# EasyEDA Pro project esp32s3_del_v1.eprj

# Schematic Schematic1
Board Name: Board1; Create Date: 2025-03-21; Page Name: P1; Project Name: esp32s3_del_v1; Schematic Name: Schematic1; Update Date: 2025-03-30; Company: EasyEDA.com; Page Size: A4; Version: V1.0
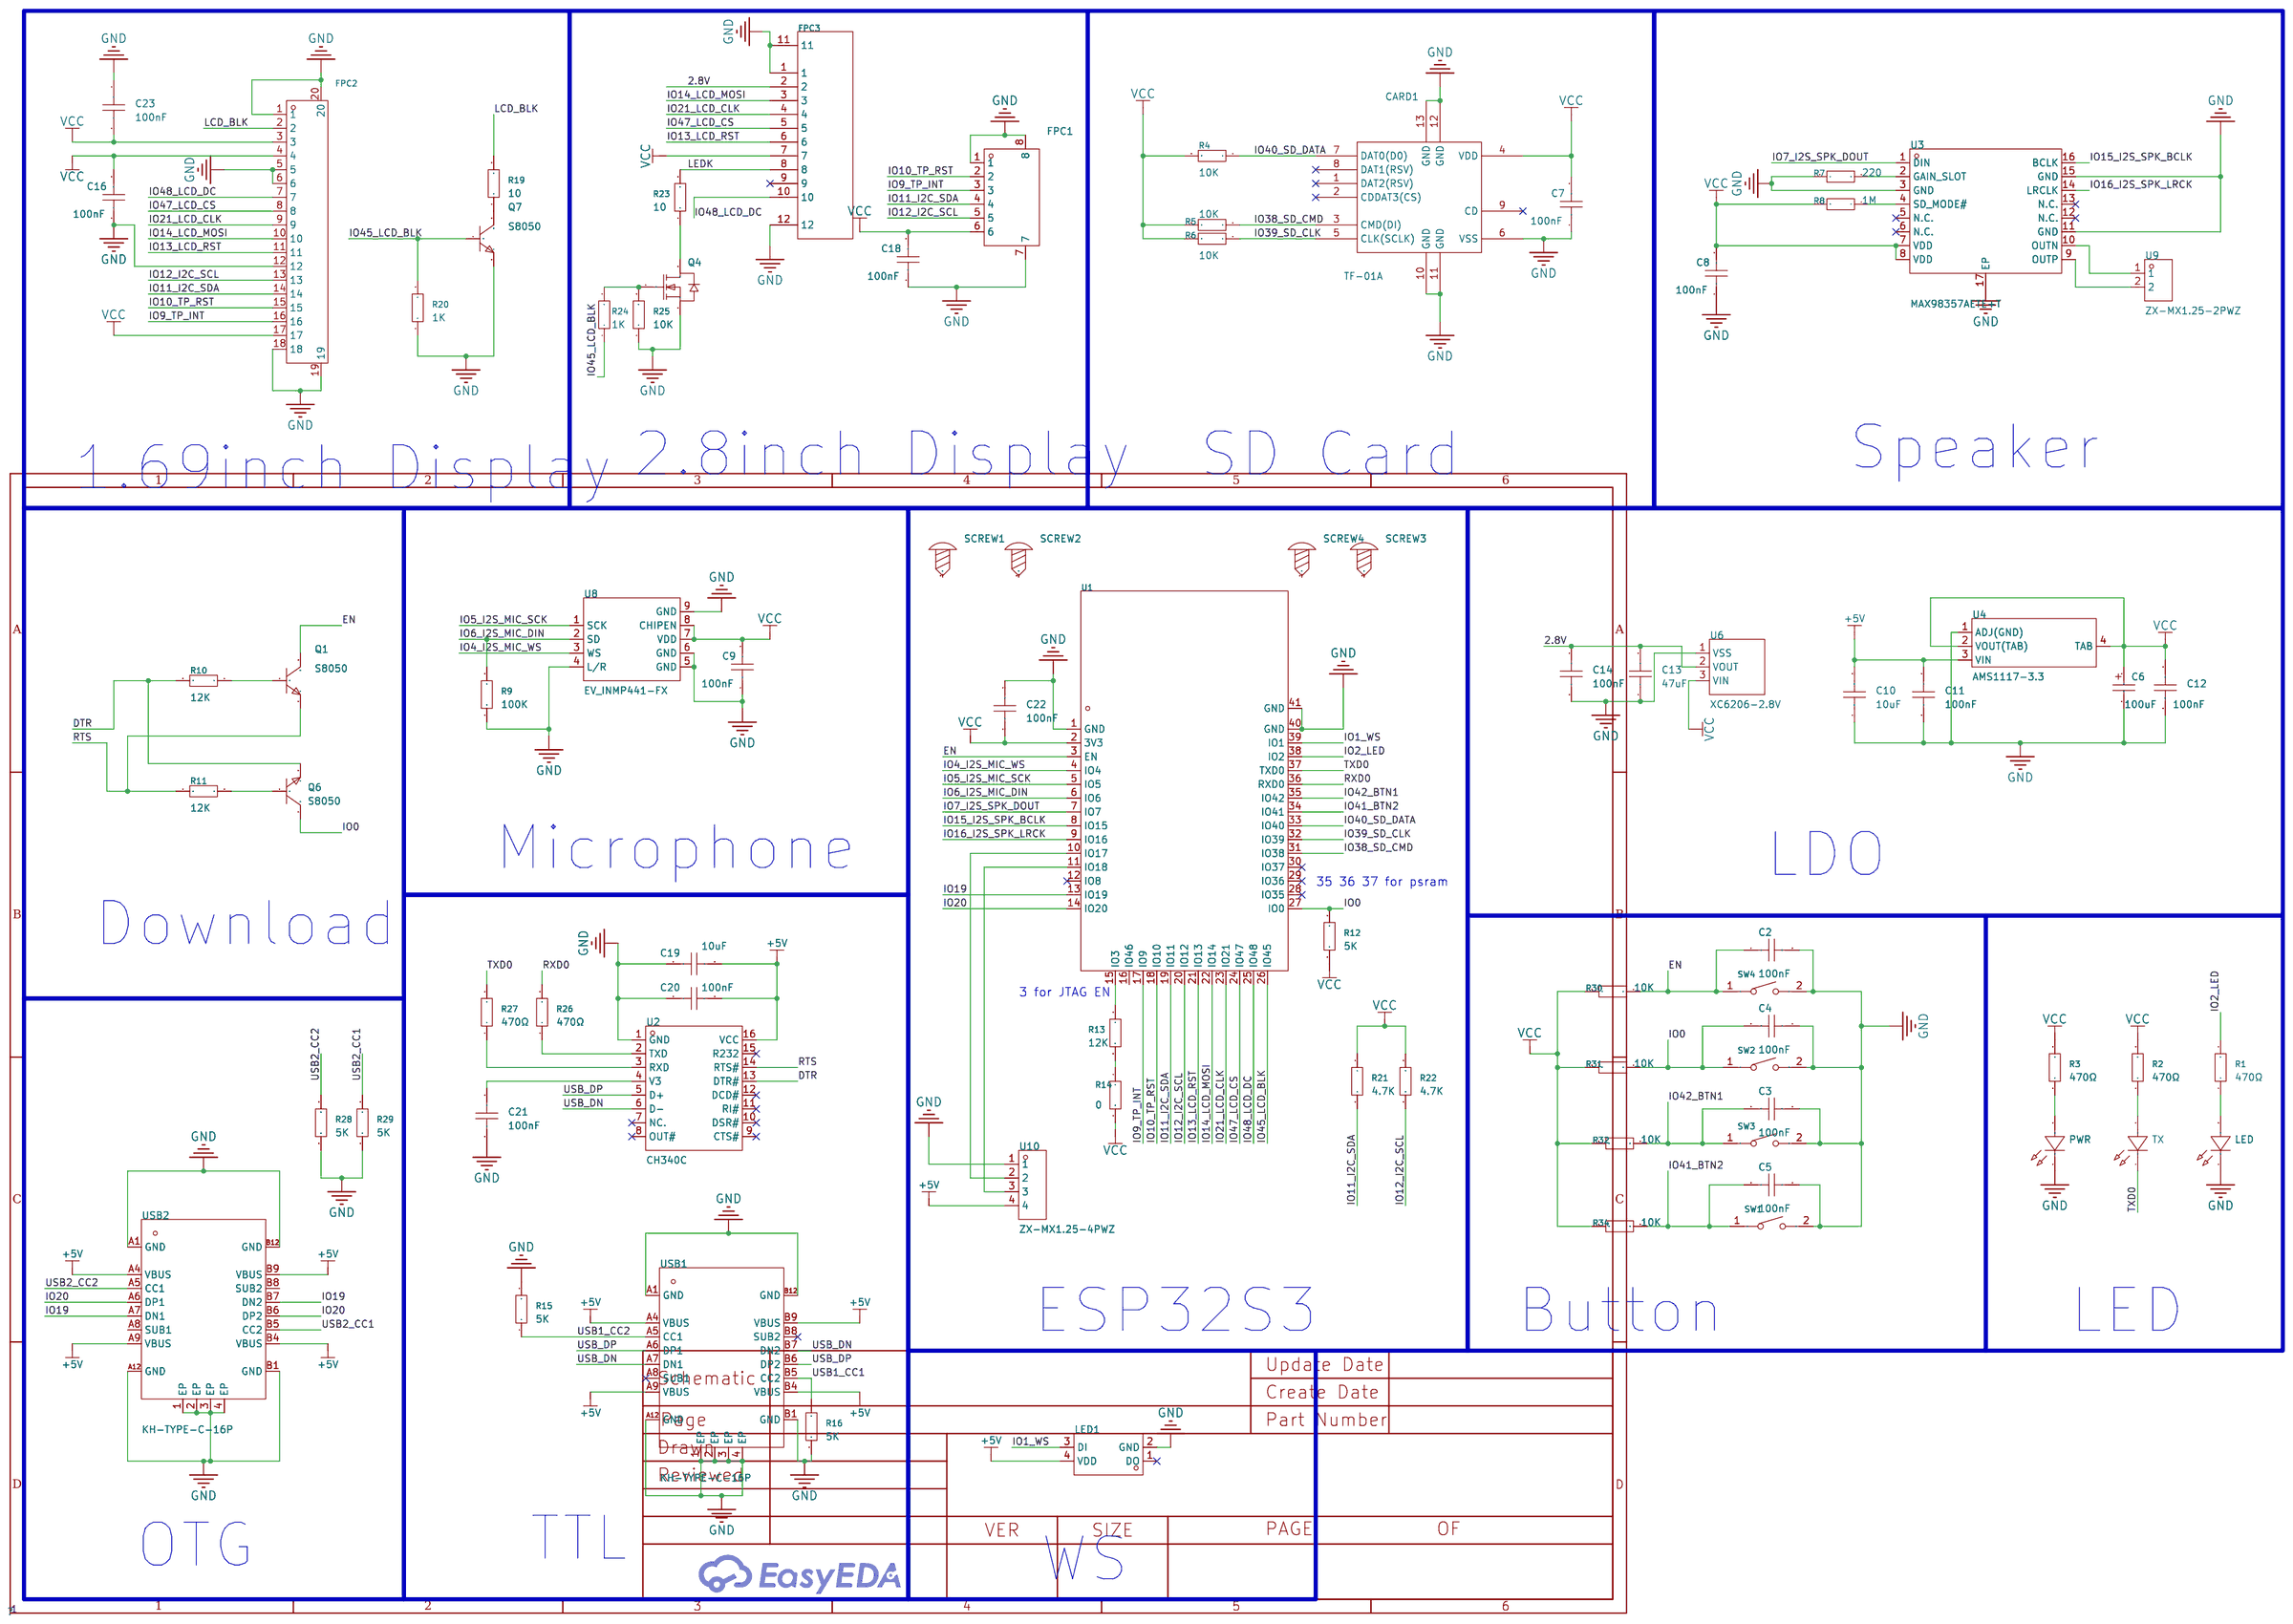
[diagram p0: schematic sheet]

## Parts
C2  100nF  [C0402]
C3  100nF  [C0402]
C4  100nF  [C0402]
C5  100nF  [C0402]
C6  100uF  [CASE-B_3528]
C7  100nF  [C0402]
C8  100nF  [C0402]
C9  100nF  [C0402]
C10  10uF  [C0603]
C11  100nF  [C0402]
C12  100nF  [C0402]
C13  47uF  [C0603]
C14  100nF  [C0402]
C16  100nF  [C0402]
C18  100nF  [C0402]
C19  10uF  [C0603]
C20  100nF  [C0402]
C21  100nF  [C0402]
C22  100nF  [C0402]
C23  100nF  [C0402]
CARD1  TF-01A  [TF-SMD_TF-01A]
FPC1  0.5K-DX-6PWBG  [FPC-SMD_6P-P0.50_DEALON_0.5K-DX-6PWB]
FPC2  FPC-05F-18PH20  [FPC-SMD_18P-P0.50_FPC-05F-18PH20]
FPC3  AFC07-S10ECA-00  [FPC-SMD_P0.50-10P_LCS-SJ-H2.0]
LED  XL-1608SURC-06  [LED0603-RD_RED]
LED1  XL-2020RGBC-WS2812B  [LED-SMD_4P-L2.0-W2.0-BR-1]
PWR  XL-1608SURC-06  [LED0603-RD_RED]
Q1  S8050  [SOT-23-3_L2.9-W1.3-P1.90-LS2.3-BR]
Q4  Si2302CDS-T1-GE3  [SOT-23_L2.9-W1.3-P1.90-LS2.4-BR]
Q6  S8050  [SOT-23-3_L2.9-W1.3-P1.90-LS2.3-BR]
Q7  S8050  [SOT-23-3_L2.9-W1.3-P1.90-LS2.3-BR]
R1  470Ω  [R0402]
R2  470Ω  [R0402]
R3  470Ω  [R0402]
R4  10K  [R0402]
R5  10K  [R0402]
R6  10K  [R0402]
R7  220  [R0402]
R8  1M  [R0402]
R9  100K  [R0402]
R10  12K  [R0402]
R11  12K  [R0402]
R12  5K  [R0402]
R13  12K  [R0402]
R14  0  [R0402]
R15  5K  [R0402]
R16  5K  [R0402]
R19  10  [R0402]
R20  1K  [R0402]
R21  4.7K  [R0402]
R22  4.7K  [R0402]
R23  10  [R0402]
R24  1K  [R0402]
R25  10K  [R0402]
R26  470Ω  [R0402]
R27  470Ω  [R0402]
R28  5K  [R0402]
R29  5K  [R0402]
R30  10K  [R0402]
R31  10K  [R0402]
R32  10K  [R0402]
R34  10K  [R0402]
SCREW1  -  [Screw-Hole-M2]
SCREW2  -  [Screw-Hole-M2]
SCREW3  -  [Screw-Hole-M2]
SCREW4  -  [Screw-Hole-M2]
SW1  TS-1088-AR02016  [SW-SMD_L3.9-W3.0-P4.45]
SW2  TS-1088-AR02016  [SW-SMD_L3.9-W3.0-P4.45]
SW3  TS-1088-AR02016  [SW-SMD_L3.9-W3.0-P4.45]
SW4  TS-1088-AR02016  [SW-SMD_L3.9-W3.0-P4.45]
TX  XL-1608SURC-06  [LED0603-RD_RED]
U1  ESP32-S3-WROOM-1-N16R8  [WIRELM-SMD_ESP32-S3-WROOM-1]
U2  CH340C  [SOP-16_L10.0-W3.9-P1.27-LS6.0-BL]
U3  MAX98357AETE+T  [TQFN-16_L3.0-W3.0-P0.50-BL-EP1.5]
U4  AMS1117-3.3  [SOT-223-4_L6.5-W3.5-P2.30-LS7.0-BR]
U6  XC6206-2.8V  [SOT-23-3_L2.9-W1.6-P1.90-LS2.8-BR]
U8  EV_INMP441-FX  [MID-SMD_L4.7-W3.8_INMP441ACEZ]
U9  ZX-MX1.25-2PWZ  [CONN-TH_2P-P1.25_ZX-MX1.25-2PWZ]
U10  ZX-MX1.25-4PWZ  [CONN-TH_4P-P1.25_ZX-MX1.25-4PWZ]
USB1  KH-TYPE-C-16P  [USB-C-SMD_KH-TYPE-C-16P]
USB2  KH-TYPE-C-16P  [USB-C-SMD_KH-TYPE-C-16P]

## Library data of the parts
C2-C5 C7-C9 C11 C12 C14 C16 C18 C20-C23 = CL05B104KO5NNNC: LCSC Part Name: 100nF ±10% 16V; Supplier Part: C1525; Manufacturer: SAMSUNG(三星); Supplier Footprint: 0402; JLCPCB Part Class: Basic Part; Datasheet: https://atta.szlcsc.com/upload/public/pdf/source/20160218/1457707763339.pdf; Supplier: LCSC; Tolerance: ±10%
C6 = TAJB107K006RNJ: LCSC Part Name: 100uF ±10% 6.3V; Supplier Part: C16133; Manufacturer: Kyocera AVX; Supplier Footprint: CASE-B-3528-21(mm); JLCPCB Part Class: Basic Part; Datasheet: https://atta.szlcsc.com/upload/public/pdf/source/20160107/1457707750344.pdf; Supplier: LCSC; Tolerance: ±10%; Equivalent Series Resistance(ESR): 1.7Ω@100kHz; Operating Temperature: -55℃~+125℃
C10 C13 C19 = CGA0603X5R106K100JT: LCSC Part Name: 10uF ±10% 10V; Supplier Part: C6119842; Manufacturer: HRE(芯声); Supplier Footprint: 0603; JLCPCB Part Class: Extended Part; Supplier: LCSC; Tolerance: ±10%; Voltage Rating: 10V; Temperature Coefficient: X5R
CARD1 = TF-01A_C91145: LCSC Part Name: 自弹式 MicroSD卡(TF卡) 卡座; Supplier Part: C91145; Manufacturer: 韩国韩荣; Supplier Footprint: SMD; JLCPCB Part Class: Extended Part; Datasheet: https://atta.szlcsc.com/upload/public/pdf/source/20190322/C91145_63CBD6FB4639A3A3EC6A9721F18AE0FB.pdf; Supplier: LCSC; Card Connection Mode: Self-bouncing; Card Type: MicroSD card (TF card); Connector Type: Card Slot; Supplementary Features: With Locating Pin; Maximum Body Height: 1.85mm
FPC1 = 0.5K-DX-6PWBG: LCSC Part Name: 间距:0.5mm P数:6P 翻盖式 下接; Supplier Part: C2911878; Manufacturer: HDGC(华德共创); Supplier Footprint: SMD,P=0.5mm,卧贴; JLCPCB Part Class: Extended Part; Datasheet: https://atta.szlcsc.com/upload/public/pdf/source/20211029/EDC59C5BA257836333CAE013AFC084A6.pdf; Supplier: LCSC; Locking Feature: Flip type; Contact Type: Bottom Contact; Number of Contacts: 6P; Pitch: 0.5mm; Mounting Type: Horizontal attachment; FFC, FCB Thickness: 0.3mm; Height Above Board: 2mm; Operating Temperature Range: -20℃~+85℃
FPC2 = FPC-05F-18PH20: LCSC Part Name: 间距:0.5mm P数:18P 翻盖式 下接; Supplier Part: C2856802; Manufacturer: XUNPU(讯普); Supplier Footprint: SMD,P=0.5mm,卧贴; JLCPCB Part Class: Extended Part; Datasheet: https://atta.szlcsc.com/upload/public/pdf/source/20210922/C2856802_2A845D1961F33AEC1ED22CECB292335F.pdf; Supplier: LCSC; Locking Feature: Clamshell; Contact Type: Bottom Contact; Number of Contacts: 18P; Pitch: 0.5mm; Mounting Type: 卧贴; FFC, FCB Thickness: 0.3mm; Height Above Board: 2mm; Operating Temperature Range: -25℃~+85℃
FPC3 = AFC07-S10ECA-00: LCSC Part Name: 间距:0.5mm P数:10P 抽屉式 上接; Supplier Part: C262583; Manufacturer: JS(钜硕电子); Supplier Footprint: SMD,P=0.5mm,卧贴; JLCPCB Part Class: Extended Part; Datasheet: https://atta.szlcsc.com/upload/public/pdf/source/20190726/C11082_A2E7B12387019CE4314BB5199EE0FDF4.pdf; Supplier: LCSC; Locking Feature: 抽屉式; Contact Type: Contact,Top; Number of Contacts: 10P; Pitch: 0.5mm; Mounting Type: 卧贴; FFC, FCB Thickness: 0.3mm; Height Above Board: 2mm
LED PWR TX = XL-1608SURC-06: Supplier Part: C965799; Manufacturer: XINGLIGHT(成兴光); Supplier Footprint: 0603; JLCPCB Part Class: Extended Part; Datasheet: https://atta.szlcsc.com/upload/public/pdf/source/20250213/F9766CE804AF391355DCDD48DB3E0DAB.pdf; Supplier: LCSC; Illumination Color: Red; Voltage - Forward(Vf): 2.3V; Power(Watts): 50mW; Forward Current: 20mA; Wavelength - Dominant: 620nm~630nm; Peak Wavelength: 625nm; Lens Color: Colorless Transparent Lens; Luminous Intensity: 225mcd; Viewing Angle: 120°; Mounting Sytle: Positive Stick; Operating Temperature: -20℃~+85℃
LED1 = XL-2020RGBC-WS2812B: LCSC Part Name: 幻彩透明; Supplier Part: C5349955; Manufacturer: XINGLIGHT(成兴光); Supplier Footprint: 2020; JLCPCB Part Class: Extended Part; Datasheet: https://atta.szlcsc.com/upload/public/pdf/source/20230111/97A2D5930F183799801175706AF118AF.pdf; Supplier: LCSC; Wavelength: 620nm~625nm；470nm~475nm；525nm~530nm; Luminous Intensity: 150mcd；150mcd；400mcd; Lens Color: Translucent Fog Lens; Installation method: Positive Stick; Operating Temperature: -20℃~+85℃
Q1 Q6 Q7 = S8050_C20069125: LCSC Part Name: hFE:200-350，丝印:J3Y S8050; Supplier Part: C20069125; Manufacturer: 宏嘉诚; Supplier Footprint: SOT-23; JLCPCB Part Class: Extended Part; Datasheet: https://atta.szlcsc.com/upload/public/pdf/source/20250107/343E8B94B5C24D0D65D7D4B70E0B73F6.pdf; Supplier: LCSC; type: NPN; Pd - Power Dissipation: 300mW; DC Current Gain: 120@50mA,1.0V; Transition frequency(fT): 100MHz; Current - Collector Cutoff: 100nA; Vce Saturation(VCE(sat)): 600mV; Operating Temperature: -55℃~+150℃
Q4 = Si2302CDS-T1-GE3: LCSC Part Name: 1个N沟道 耐压:20V 电流:2.9A; Supplier Part: C10488; Manufacturer: VISHAY(威世); Supplier Footprint: SOT-23; JLCPCB Part Class: Extended Part; Datasheet: https://atta.szlcsc.com/upload/public/pdf/source/20121215/1457706570095.pdf; Supplier: LCSC; Type: 1 N-Channel; Drain Source On Resistance (RDS(on)@Vgs,Id): 0.057Ω@4.5V,3.6A; Power Dissipation (Pd): 550mW; Gate Threshold Voltage (Vgs(th)@Id): 850mV@250uA; Total Gate Charge (Qg@Vgs): 3.5nC@4.5V; Input Capacitance (Ciss@Vds): 320pF@10V; Reverse Transfer Capacitance (Crss@Vds): 5pF@10V; Operating Temperature: -55℃~+150℃
R1-R16 R19-R32 R34 = 0402WGF4700TCE: LCSC Part Name: 470Ω ±1% 62.5mW 厚膜电阻; Supplier Part: C25117; Manufacturer: UNI-ROYAL(厚声); Supplier Footprint: 0402; JLCPCB Part Class: Basic Part; Datasheet: https://atta.szlcsc.com/upload/public/pdf/source/20200306/C422600_1E6D84923E4A46A82E41ADD87F860B5C.pdf; Supplier: LCSC; Type: Thick Film Resistors; Tolerance: ±1%; Temperature Coefficient: ±100ppm/℃; Operating Temperature Range: -55℃~+155℃
SCREW1-SCREW4 = Screw-Hole-M2: Supplier Footprint: 插件
SW1-SW4 = TS-1088-AR02016: LCSC Part Name: 4*3*2mm 立贴 轻触开关; Supplier Part: C720477; Manufacturer: XUNPU(讯普); Supplier Footprint: SMD; JLCPCB Part Class: Extended Part; Datasheet: https://atta.szlcsc.com/upload/public/pdf/source/20200810/C720475_60D09DD6C54279ADDB2DC25100F1CC11.pdf; Supplier: LCSC; Circuit: SPST; Actuator Style: Round Button; Operating Force: 160gf; Mounting Style: Brick nogging; Switch Length: 4mm; Switch Width: 3mm; Switch Height: 2mm; Strike Gundam: 不带; Contact Current: 50mA; Voltage Rating (DC): 12V; Insulation Resistance: 100MΩ; Actuator/Cap Color: Black; Pin Style: SMDSplicing; Mechanical Life: 10万次; Operating Temperature: -30℃~+80℃
U1 = ESP32-S3-WROOM-1-N16R8: LCSC Part Name: 通用型Wi-Fi+低功耗蓝牙MCU模组; Supplier Part: C2913202; Manufacturer: ESPRESSIF(乐鑫); Supplier Footprint: SMD,18x25.5mm; JLCPCB Part Class: Extended Part; Datasheet: https://atta.szlcsc.com/upload/public/pdf/source/20220705/4E799F39581577F766659887F738A439.pdf; Supplier: LCSC
U2 = CH340C: LCSC Part Name: CH340C USB转串口芯片 CH340; Supplier Part: C84681; Manufacturer: WCH(南京沁恒); Supplier Footprint: SOP-16; JLCPCB Part Class: Extended Part; Datasheet: https://atta.szlcsc.com/upload/public/pdf/source/20240619/63986D8440D4E5267A77ACD891CC4DE3.pdf; Supplier: LCSC; Applications Function: Transceiver; Supply Voltage: 3.3V；5V; Data Rate: 2Mbps
U3 = MAX98357AETE+T: LCSC Part Name: 微型、低成本、PCM 类 D 级放大器具有 AB 级性能; Supplier Part: C910544; Manufacturer: ADI(亚德诺)/MAXIM(美信); Supplier Footprint: TQFN-16-EP(3x3); JLCPCB Part Class: Extended Part; Datasheet: https://atta.szlcsc.com/upload/public/pdf/source/20210106/C910544_CB6DE4B2CEE254A72E6BDB40E718D281.pdf; Supplier: LCSC; Speaker Channels: Monaural; Supply Voltage: 2.5V~5.5V; Operating Temperature: -40℃~+85℃
U4 = AMS1117-3.3_C347222: LCSC Part Name: 输出:3.3V 电流:1A 耐压:12V; Supplier Part: C347222; Manufacturer: UMW(友台半导体); Supplier Footprint: SOT-223; JLCPCB Part Class: Extended Part; Datasheet: https://atta.szlcsc.com/upload/public/pdf/source/20241218/BAF0263FA2E44BCD8AF41AA4FA04EFAA.pdf; Supplier: LCSC; Output Type: Fixed; Voltage - Supply: 12V; Output Voltage: 3.3V; Output Current: 1A; Power Supply Rejection Ratio (PSRR): 60dB@(120Hz); Voltage Dropout: 1.3V@(1A); Features: Overcurrent Protection; Output Configuration: Positive electrode; Number of Outputs: 1
U6 = XC6206-2.8V: LCSC Part Name: 输入6V 输出2.8V 250mA; Supplier Part: C2892669; Manufacturer: YONGYUTAI(永裕泰); Supplier Footprint: SOT-23-3L; JLCPCB Part Class: Extended Part; Datasheet: https://atta.szlcsc.com/upload/public/pdf/source/20210901/DE3C77F0CE73FFE8F7C655BE9B94CB06.pdf; Supplier: LCSC; Output Type: Fixed; Voltage - Supply: 6V; Output Voltage: 2.8V; Output Current: 250mA; Features: Short-Circuit  Protection(SCP)；Low ESR；Overcurrent Protection(OCP); Operating Temperature: -40℃~+85℃@(Tj); Output Configuration: Positive electrode; Number of Outputs: 1
U8 = EV_INMP441-FX: Supplier Part: C17499176; Manufacturer: TDK InvenSense(应美盛); JLCPCB Part Class: Extended Part; Supplier: LCSC; Sensor Type: Audio
U9 = ZX-MX1.25-2PWZ: LCSC Part Name: 1x2P 间距:1.25mm 弯插 系列:PicoBlade(MX 1.25) 配套胶壳型号：ZX-MX1.25-2PJK 配套端子型号：ZX-MX1.25-DZ 配套杜邦线型号：ZX-MX1.25-2PBXC; Supplier Part: C7430463; Manufacturer: Megastar(兆星); Supplier Footprint: 弯插,P=1.25mm; JLCPCB Part Class: Extended Part; Datasheet: https://atta.szlcsc.com/upload/public/pdf/source/20230619/EFC7482EB916E36F9EF0B03A9637C24F.pdf; Supplier: LCSC; Pins Structure: 1x2P; Pitch: 1.25mm; Mounting Style: Bend-in; Reference Series: PicoBlade(MX 1.25); Number of Pins: 2P; Number of Rows: 1; Number of PINs Per Row: 2; Contact Material: Brass; Contact Plating: Tin; Colour: White; Z-Height of the Board: 3.3mm; X-Length of Bottom Edge on Board (Spacing Line): 4.4mm; Y-Width of Bottom Edge on Board: 4.6mm
U10 = ZX-MX1.25-4PWZ: LCSC Part Name: 1x4P 间距:1.25mm 弯插 系列:PicoBlade(MX 1.25) 配套胶壳型号：ZX-MX1.25-4PJK 配套端子型号：ZX-MX1.25-DZ 配套杜邦线型号：ZX-MX1.25-4PBXC; Supplier Part: C7430465; Manufacturer: Megastar(兆星); Supplier Footprint: 弯插,P=1.25mm; JLCPCB Part Class: Extended Part; Datasheet: https://atta.szlcsc.com/upload/public/pdf/source/20230619/13E052D24268A9BEC4967A3768BAD5AA.pdf; Supplier: LCSC; Pins Structure: 1x4P; Pitch: 1.25mm; Mounting Style: Bend-in; Reference Series: PicoBlade(MX 1.25); Number of Pins: 4P; Number of Rows: 1; Number of PINs Per Row: 4; Contact Material: Brass; Contact Plating: Tin; Colour: White; Z-Height of the Board: 3.3mm; X-Length of Bottom Edge on Board (Spacing Line): 6.9mm; Y-Width of Bottom Edge on Board: 4.6mm
USB1 USB2 = KH-TYPE-C-16P: LCSC Part Name: Type-C 母 卧贴; Supplier Part: C709357; Manufacturer: kinghelm(金航标); Supplier Footprint: SMD; JLCPCB Part Class: Extended Part; Datasheet: https://atta.szlcsc.com/upload/public/pdf/source/20200911/C709357_AA8DCEB38BB20E3035A7ED7AE7667837.pdf; Supplier: LCSC; Connector Type: Type-C; Gender: Female; Number of Ports: 1; Number of Contacts: 16P; Mounting Style: 卧贴; Current Rating - Power (Max): 3A; Operating Temperature Range: -40℃~+85℃

## Nets
2.8V: C13.2 C14.1 FPC3.2 U6.2(VOUT)
+5V: C10.2 C11.1 C19.1 C20.2 LED1.4(VDD) U2.16(VCC) U4.3(VIN) U10.4 USB1.A4(VBUS) USB1.A9(VBUS) USB1.B4(VBUS) USB1.B9(VBUS) USB2.A4(VBUS) USB2.A9(VBUS) USB2.B4(VBUS) USB2.B9(VBUS)
GND: C2.2 C3.1 C4.1 C5.1 C6.2 C7.1 C8.1 C9.1 C10.1 C11.2 C12.2 C13.1 C14.2 C16.1 C18.1 C19.2 C20.1 C21.1 C22.1 C23.1 CARD1.6(VSS) CARD1.10(GND) CARD1.11(GND) CARD1.12(GND) CARD1.13(GND) FPC1.1 FPC1.7 FPC1.8 FPC2.1 FPC2.5 FPC2.6 FPC2.12 FPC2.18 FPC2.19 FPC2.20 FPC3.1 FPC3.11 FPC3.12 LED.1(K) LED1.2(GND) PWR.1(K) Q4.2(S) Q7.2(E) R7.2 R9.1 R15.2 R16.1 R20.1 R25.1 R28.1 R29.1 SW1.2 SW2.2 SW3.2 SW4.2 U1.1(GND) U1.40(GND) U1.41(GND) U2.1(GND) U3.3(GND) U3.11(GND) U3.15(GND) U3.17(EP) U4.1(ADJ(GND)) U6.1(VSS) U8.4(L/R) U8.5(GND) U8.6(GND) U8.9(GND) U10.1 USB1.1(EP) USB1.2(EP) USB1.3(EP) USB1.4(EP) USB1.A1(GND) USB1.A12(GND) USB1.B1(GND) USB1.B12(GND) USB2.1(EP) USB2.2(EP) USB2.3(EP) USB2.4(EP) USB2.A1(GND) USB2.A12(GND) USB2.B1(GND) USB2.B12(GND)
VCC: C6.1 C7.2 C8.2 C9.2 C12.1 C16.2 C18.2 C22.2 C23.2 CARD1.4(VDD) FPC1.6 FPC2.3 FPC2.4 FPC2.17 FPC3.7 R2.2 R3.2 R4.2 R5.2 R6.2 R8.2 R12.2 R14.2 R21.1 R22.1 R30.2 R31.2 R32.2 R34.2 U1.2(3V3) U3.7(VDD) U3.8(VDD) U4.2(VOUT(TAB)) U4.4(TAB) U6.3(VIN) U8.7(VDD) U8.8(CHIPEN)
DTR: Q6.2(E) R10.2 U2.13(DTR#)
EN: C2.1 Q1.3(C) R30.1 SW4.1 U1.3(EN)
IO0: C4.2 Q6.3(C) R12.1 R31.1 SW2.1 U1.27(IO0)
IO1_WS: LED1.3(DI) U1.39(IO1)
IO2_LED: R1.2 U1.38(IO2)
IO4_I2S_MIC_WS: U1.4(IO4) U8.3(WS)
IO5_I2S_MIC_SCK: U1.5(IO5) U8.1(SCK)
IO6_I2S_MIC_DIN: R9.2 U1.6(IO6) U8.2(SD)
IO7_I2S_SPK_DOUT: U1.7(IO7) U3.1(DIN)
IO9_TP_INT: FPC1.3 FPC2.16 U1.17(IO9)
IO10_TP_RST: FPC1.2 FPC2.15 U1.18(IO10)
IO11_I2C_SDA: FPC1.4 FPC2.14 R21.2 U1.19(IO11)
IO12_I2C_SCL: FPC1.5 FPC2.13 R22.2 U1.20(IO12)
IO13_LCD_RST: FPC2.11 FPC3.6 U1.21(IO13)
IO14_LCD_MOSI: FPC2.10 FPC3.3 U1.22(IO14)
IO15_I2S_SPK_BCLK: U1.8(IO15) U3.16(BCLK)
IO16_I2S_SPK_LRCK: U1.9(IO16) U3.14(LRCLK)
IO19: U1.13(IO19) USB2.A7(DN1) USB2.B7(DN2)
IO20: U1.14(IO20) USB2.A6(DP1) USB2.B6(DP2)
IO21_LCD_CLK: FPC2.9 FPC3.4 U1.23(IO21)
IO38_SD_CMD: CARD1.3(CMD(DI)) R5.1 U1.31(IO38)
IO39_SD_CLK: CARD1.5(CLK(SCLK)) R6.1 U1.32(IO39)
IO40_SD_DATA: CARD1.7(DAT0(D0)) R4.1 U1.33(IO40)
IO41_BTN2: C5.2 R34.1 SW1.1 U1.34(IO41)
IO42_BTN1: C3.2 R32.1 SW3.1 U1.35(IO42)
IO45_LCD_BLK: Q7.1(B) R20.2 R24.1 U1.26(IO45)
IO47_LCD_CS: FPC2.8 FPC3.5 U1.24(IO47)
IO48_LCD_DC: FPC2.7 FPC3.10 U1.25(IO48)
LCD_BLK: FPC2.2 R19.2
LEDK: FPC3.8 R23.2
RTS: Q1.2(E) R11.2 U2.14(RTS#)
RXD0: R26.2 U1.36(RXD0)
TXD0: R27.2 TX.1(K) U1.37(TXD0)
USB1_CC1: R16.2 USB1.B5(CC2)
USB1_CC2: R15.1 USB1.A5(CC1)
USB2_CC1: R29.2 USB2.B5(CC2)
USB2_CC2: R28.2 USB2.A5(CC1)
USB_DN: U2.6(D-) USB1.A7(DN1) USB1.B7(DN2)
USB_DP: U2.5(D+) USB1.A6(DP1) USB1.B6(DP2)
$1N5016: R7.1 U3.2(GAIN_SLOT)
$1N5089: R8.1 U3.4(SD_MODE#)
$1N5351: U3.10(OUTN) U9.1
$1N5372: U3.9(OUTP) U9.2
$1N6944: Q1.1(B) R10.1
$1N6949: Q6.1(B) R11.1
$1N7412: PWR.2(A) R3.1
$1N7416: R2.1 TX.2(A)
$1N7421: LED.2(A) R1.1
$1N7694: R13.1 U1.15(IO3)
$1N7805: R13.2 R14.1
$1N9339: Q4.1(G) R24.2 R25.2
$1N9344: Q4.3(D) R23.1
$1N9896: R26.1 U2.2(TXD)
$1N9901: R27.1 U2.3(RXD)
$1N9958: C21.2 U2.4(V3)
$1N14603: U1.10(IO17) U10.2
$1N14611: U1.11(IO18) U10.3
$1N17288: Q7.3(C) R19.1

Not connected (* = marked no-connect by the designer): CARD1 1(DAT2(RSV))* 2(CDDAT3(CS))* 8(DAT1(RSV))* 9(CD)*; FPC3 9*; LED1 1(DO)*; SCREW1 1; SCREW2 1; SCREW3 1; SCREW4 1; U1 12(IO8)* 16(IO46) 28(IO35)* 29(IO36)* 30(IO37)*; U2 7(NC.)* 8(OUT#)* 9(CTS#)* 10(DSR#)* 11(RI#)* 12(DCD#)* 15(R232)*; U3 5(N.C.)* 6(N.C.)* 12(N.C.)* 13(N.C.)*; USB1 A8(SUB1)* B8(SUB2)*; USB2 A8(SUB1) B8(SUB2)

## Notes on the sheet
- Speaker
- 2.8inch Display
- SD Card
- 1.69inch Display
- Microphone
- LDO
- 35 36 37 for psram
- Download
- 3 for JTAG EN
- ESP32S3
- Button
- LED
- TTL
- OTG
- WS

# Board PCB1
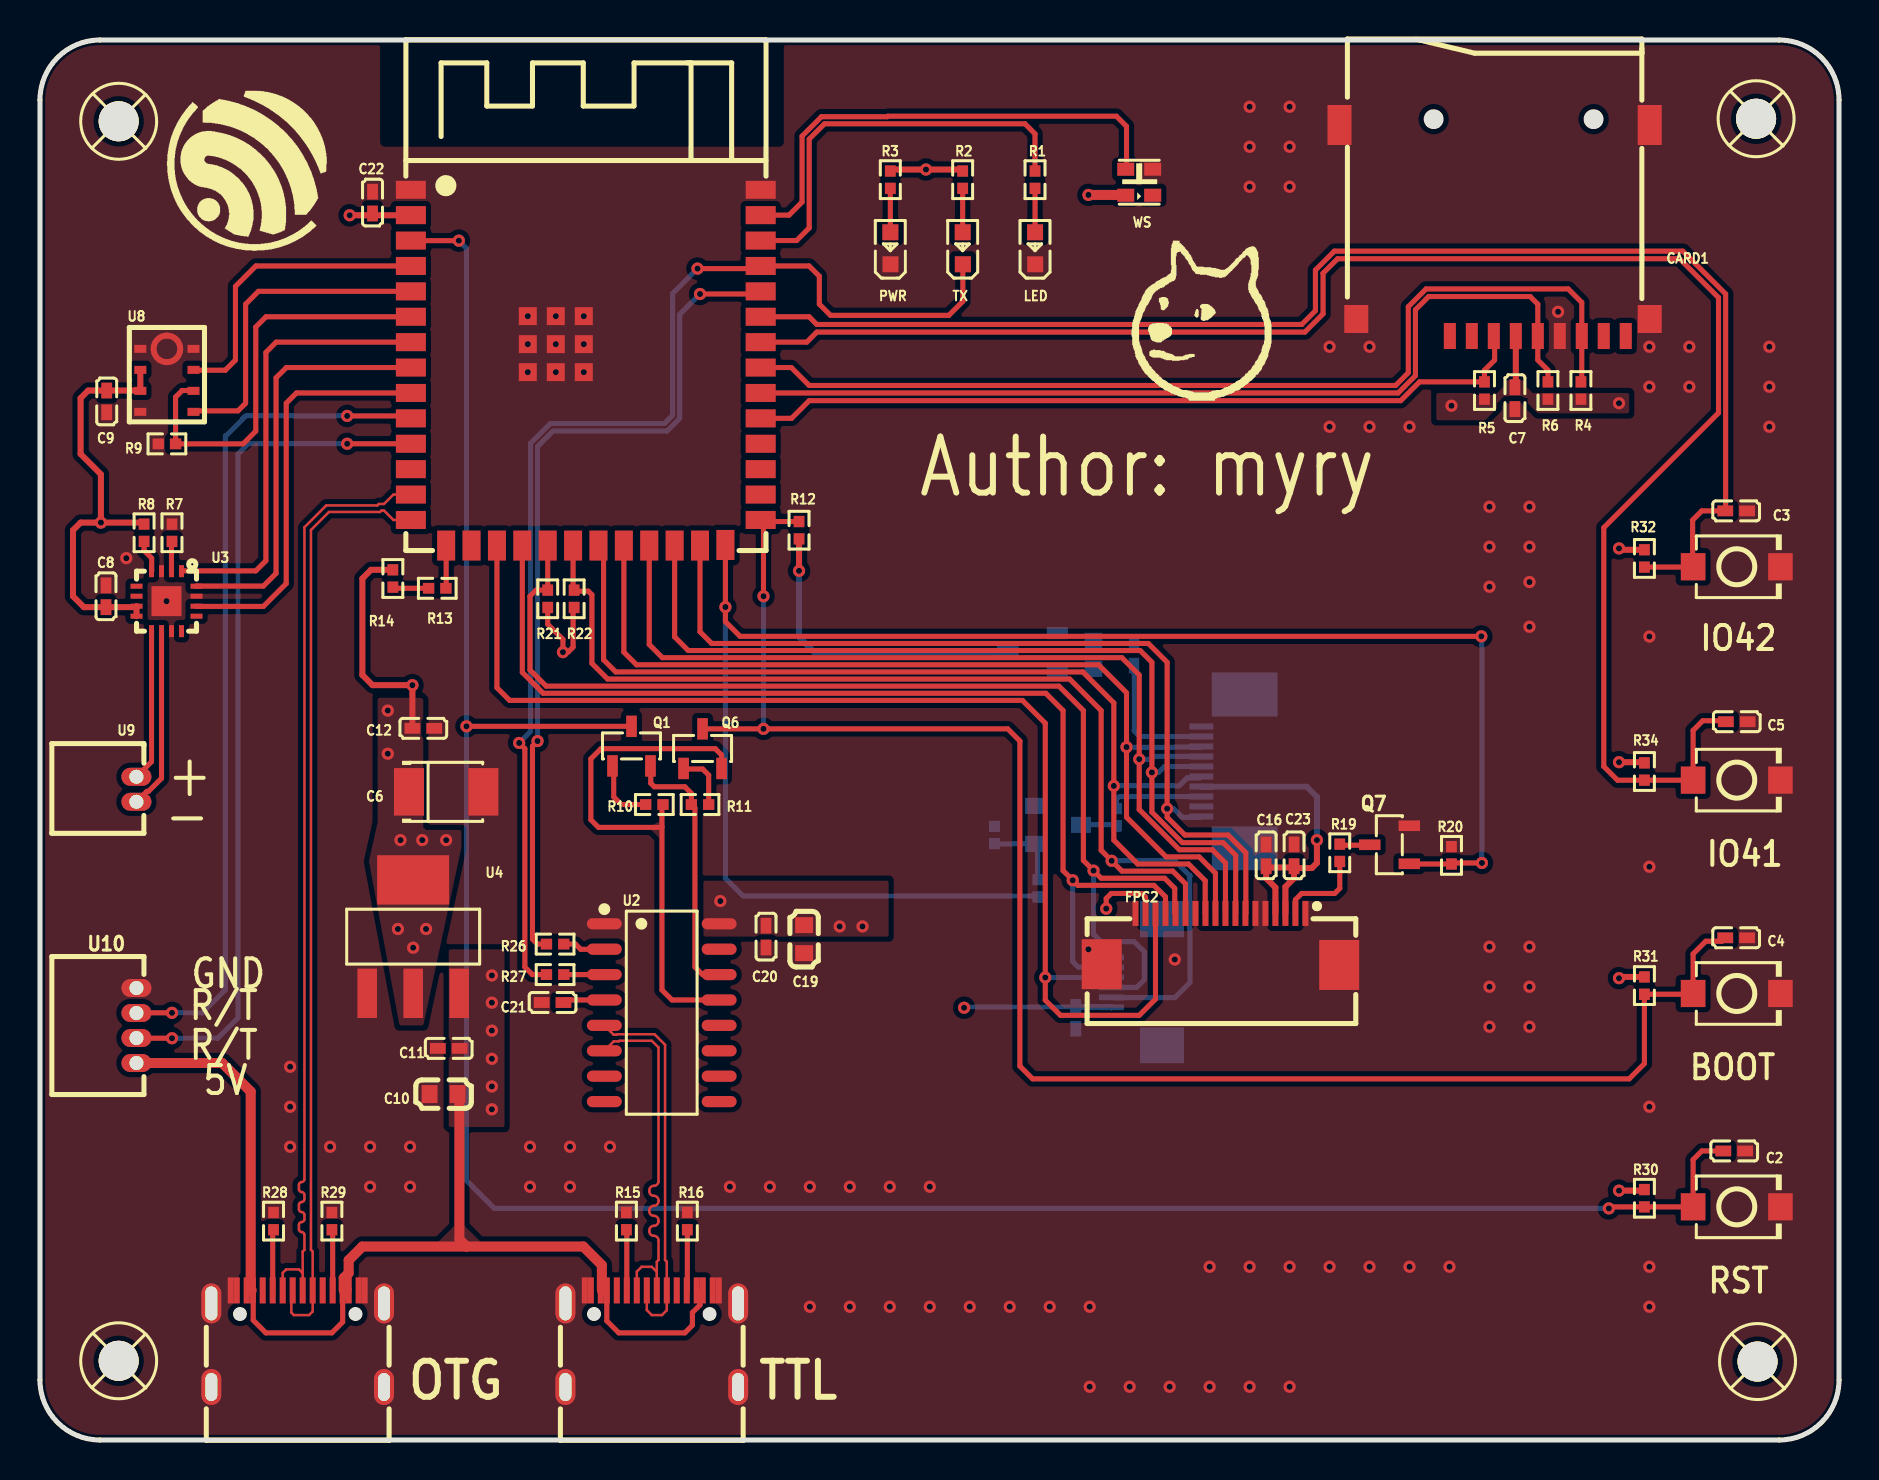
[diagram p1: board, top side]
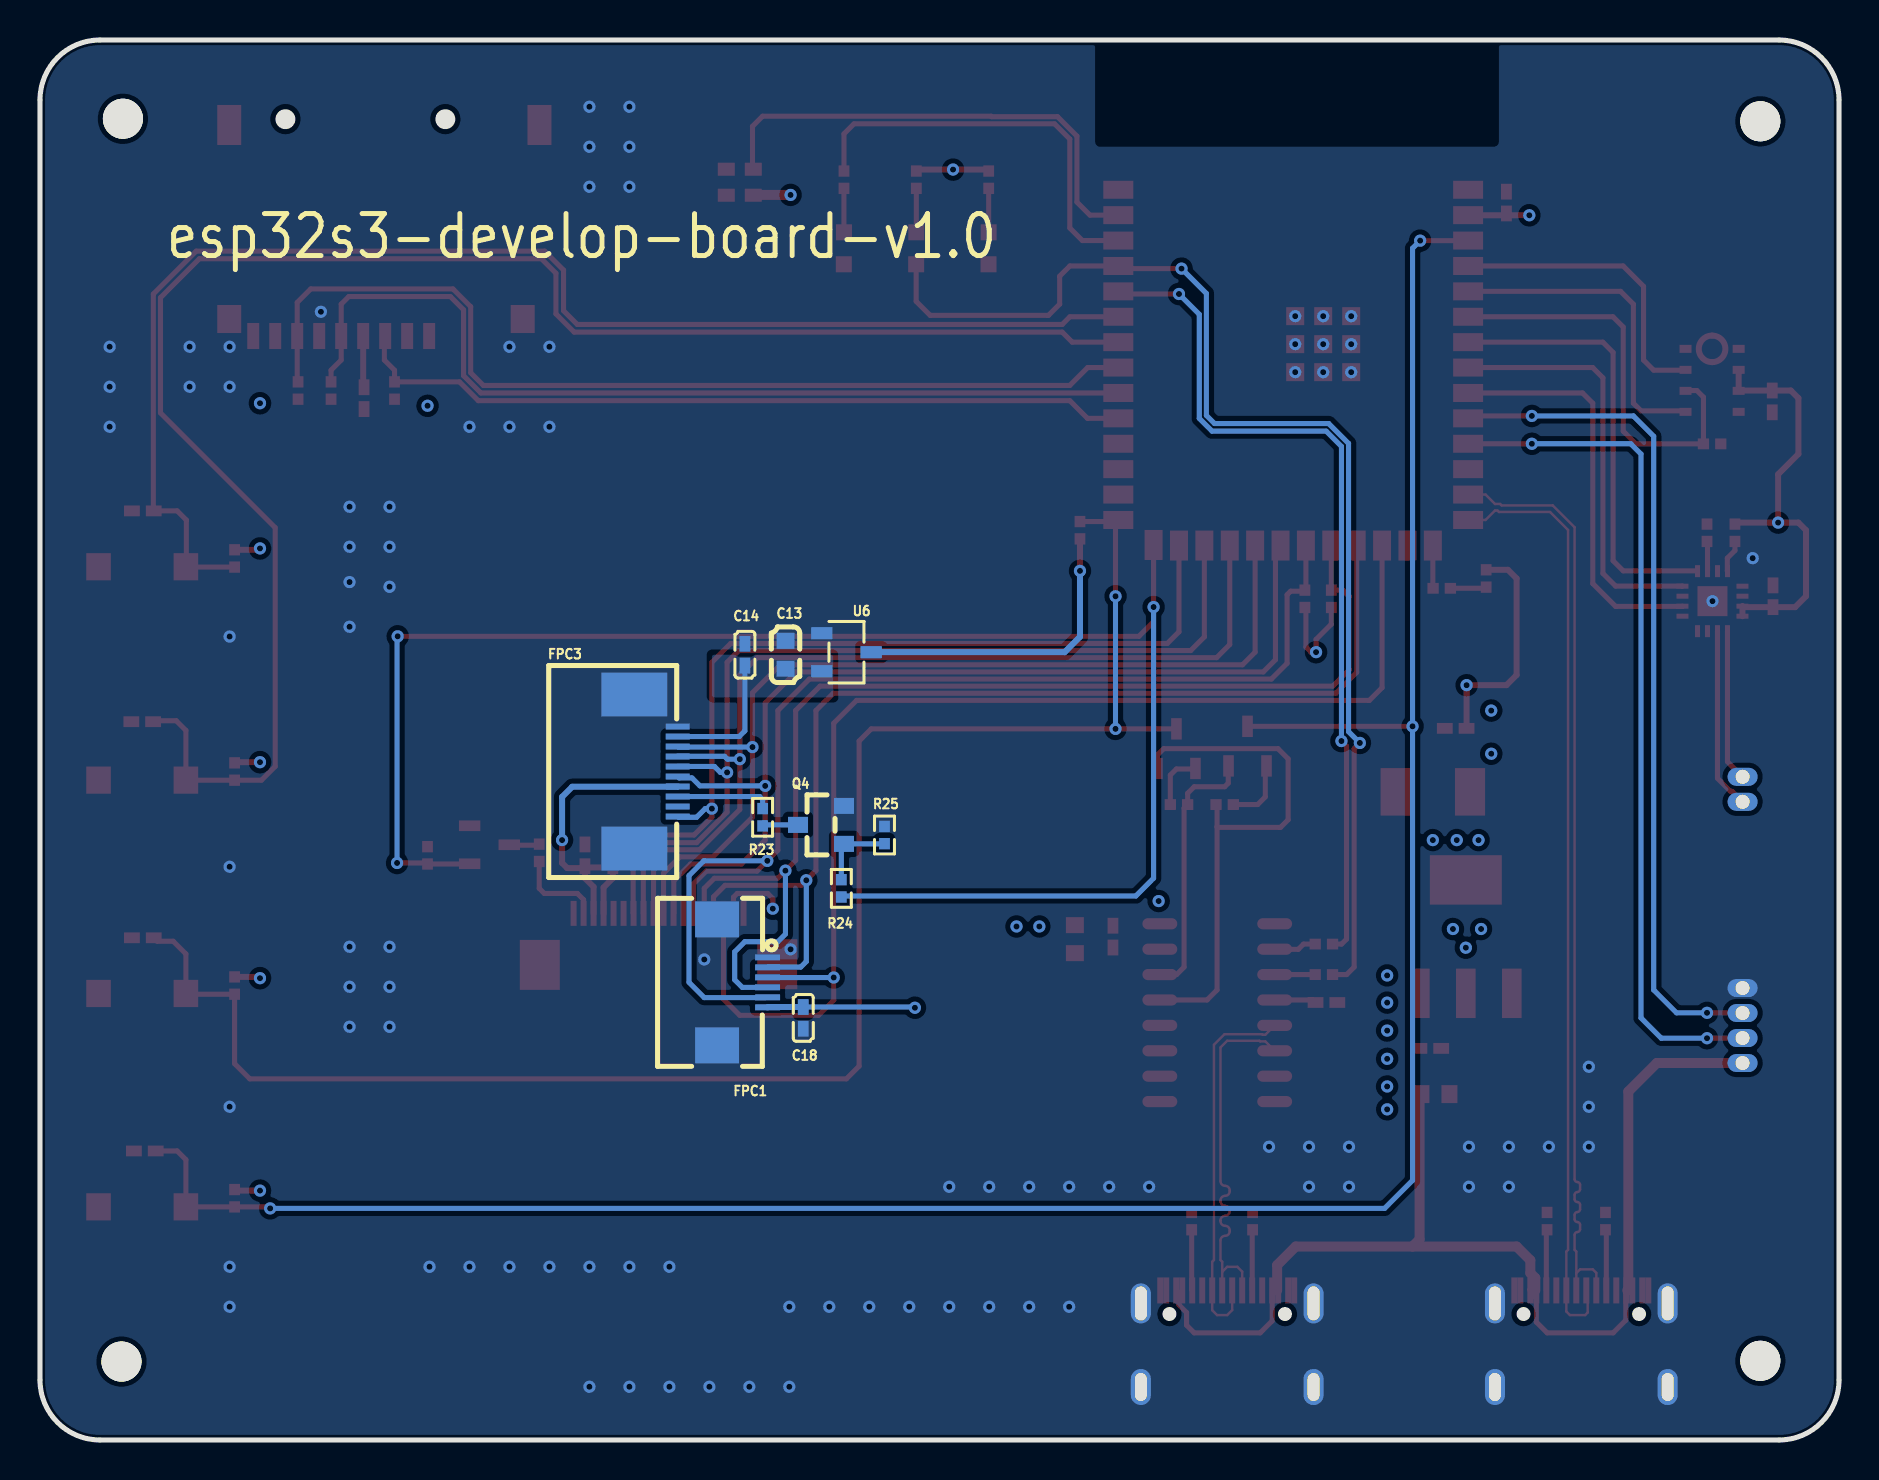
[diagram p2: board, bottom side, seen from below]

Outline 90 x 70 mm; copper layers: Top Layer, GND, PWR, Bottom Layer. Coordinates in mm from the lower left corner of the outline.
Outline path: 0,67 0,3 arc(0.88,0.88) 3,0 87,0 arc(89.12,0.88) 90,3 90,67 arc(89.12,69.12) 87,70 3,70 arc(0.88,69.12) 0,67
Stack: Top Layer 0.035mm Outer layer copper thickness 1oz / Dielectric1 0.2104mm 7628 RC49% 8.6mil / GND 0.0152mm Inner layer copper thickness / Dielectric2 1.065mm 1.1mm H/HOZ Copper / PWR 0.0152mm Inner layer copper thickness / Dielectric3 0.2104mm 7628 RC49% 8.6mil / Bottom Layer 0.035mm Outer layer copper thickness 1oz

## Design rules (mm)
net IO19: DP1
net IO20: DP1
template: Custom Config
spacing copperThickness1oz (default): track to track 0.102, other pairs 0.152 to 0.3
spacing copperThickness2oz: track to track 0.203, other pairs 0.152 to 0.3
track width copperThickness1oz (default): min 0.124, default 0.254, max 2.54
track width copperThickness2oz: min 0.203, default 0.254, max 2.54
differential pair differentialPair (default): width min 0.124, default 0.124, max 2.54; gap min 0.203, default 0.203
via viaSize (default): diameter min 0.5, default 0.61, max 10; hole min 0.3, default 0.305, max 6.3

## Placement (name value [footprint] x y rotation side)
BOOT  TS-1088-AR02016  [SW-SMD_L3.9-W3.0-P4.45]  84.89 22.33 0 top
C2  100nF  [C0402]  84.76 14.45 0 top
C3  100nF  [C0402]  84.85 46.46 180 top
C4  100nF  [C0402]  84.85 25.11 180 top
C5  100nF  [C0402]  84.89 35.92 180 top
C6  100uF  [CASE-B_3528]  20.32 32.41 0 top
C7  100nF  [C0402]  73.79 52.09 90 top
C8  100nF  [C0402]  3.3 42.19 270 top
C9  100nF  [C0402]  3.34 51.93 90 top
C10  10uF  [C0603]  20.19 17.3 0 top
C11  100nF  [C0402]  20.45 19.58 180 top
C12  100nF  [C0402]  19.18 35.58 0 top
C13  47uF  [C0603]  52.7 39.26 270 bottom
C14  100nF  [C0402]  54.73 39.26 90 bottom
C16  100nF  [C0402]  61.34 29.23 270 top
C18  100nF  [C0402]  51.82 21.11 90 bottom
C19  10uF  [C0603]  38.23 25.04 270 top
C20  100nF  [C0402]  36.32 25.17 90 top
C21  100nF  [C0402]  25.64 21.87 0 top
C22  100nF  [C0402]  16.64 61.87 270 top
C23  100nF  [C0402]  62.74 29.23 270 top
CARD1  TF-01A  [TF-SMD_TF-01A]  72.77 60.48 180 top
FPC1  0.5K-DX-6PWBG  [FPC-SMD_6P-P0.50_DEALON_0.5K-DX-6PWB]  54.86 22.88 270 bottom
FPC2  FPC-05F-18PH20  [FPC-SMD_18P-P0.50_FPC-05F-18PH20]  59.05 25.04 0 top
FPC3  AFC07-S10ECA-00  [FPC-SMD_P0.50-10P_LCS-SJ-H2.0]  59.18 33.42 90 bottom
IO41  TS-1088-AR02016  [SW-SMD_L3.9-W3.0-P4.45]  84.89 32.99 0 top
IO42  TS-1088-AR02016  [SW-SMD_L3.9-W3.0-P4.45]  84.89 43.66 0 top
LED  XL-1608SURC-06  [LED0603-RD_RED]  49.78 59.59 90 top
OTG  KH-TYPE-C-16P  [USB-C-SMD_KH-TYPE-C-16P]  12.89 5.06 0 top
PWR  XL-1608SURC-06  [LED0603-RD_RED]  42.55 59.59 90 top
Q1  S8050  [SOT-23-3_L2.9-W1.3-P1.90-LS2.3-BR]  29.59 34.69 270 top
Q4  Si2302CDS-T1-GE3  [SOT-23_L2.9-W1.3-P1.90-LS2.4-BR]  50.93 30.76 180 bottom
Q6  S8050  [SOT-23-3_L2.9-W1.3-P1.90-LS2.3-BR]  33.15 34.57 270 top
Q7  S8050  [SOT-23-3_L2.9-W1.3-P1.90-LS2.3-BR]  67.51 29.76 0 top
R1  470Ω  [R0402]  49.78 63.02 90 top
R2  470Ω  [R0402]  46.16 63.02 90 top
R3  470Ω  [R0402]  42.54 63.02 90 top
R4  10K  [R0402]  77.09 52.47 270 top
R5  10K  [R0402]  72.26 52.47 270 top
R6  10K  [R0402]  75.44 52.47 270 top
R7  220  [R0402]  6.6 45.36 90 top
R8  1M  [R0402]  5.21 45.36 90 top
R9  100K  [R0402]  6.35 49.81 0 top
R10  12K  [R0402]  30.73 31.77 0 top
R11  12K  [R0402]  33.02 31.77 180 top
R12  5K  [R0402]  37.97 45.49 270 top
R13  12K  [R0402]  19.88 42.59 180 top
R14  0  [R0402]  17.65 43.08 90 top
R15  5K  [R0402]  29.34 10.94 90 top
R16  5K  [R0402]  32.39 10.94 270 top
R19  10  [R0402]  65.02 29.36 270 top
R20  1K  [R0402]  70.61 29.23 270 top
R21  4.7K  [R0402]  25.4 42.06 90 top
R22  4.7K  [R0402]  26.72 42.06 90 top
R23  10  [R0402]  53.85 31.14 90 bottom
R24  1K  [R0402]  49.91 27.58 90 bottom
R25  10K  [R0402]  47.75 30.25 270 bottom
R26  470Ω  [R0402]  25.77 24.8 180 top
R27  470Ω  [R0402]  25.77 23.27 180 top
R28  5K  [R0402]  11.68 10.94 270 top
R29  5K  [R0402]  14.6 10.94 270 top
R30  10K  [R0402]  80.26 12.09 90 top
R31  10K  [R0402]  80.26 22.72 90 top
R32  10K  [R0402]  80.26 44.08 90 top
R34  10K  [R0402]  80.26 33.42 90 top
RST  TS-1088-AR02016  [SW-SMD_L3.9-W3.0-P4.45]  84.89 11.66 0 top
SCREW1  -  [Screw-Hole-M2]  3.94 3.96 0 top
SCREW2  -  [Screw-Hole-M2]  85.92 3.92 0 top
SCREW3  -  [Screw-Hole-M2]  3.94 65.94 0 top
SCREW4  -  [Screw-Hole-M2]  85.85 66.06 0 top
TTL  KH-TYPE-C-16P  [USB-C-SMD_KH-TYPE-C-16P]  30.61 5.06 0 top
TX  XL-1608SURC-06  [LED0603-RD_RED]  46.16 59.59 90 top
U1  ESP32-S3-WROOM-1-N16R8  [WIRELM-SMD_ESP32-S3-WROOM-1]  27.3 53.62 0 top
U2  CH340C  [SOP-16_L10.0-W3.9-P1.27-LS6.0-BL]  31.1 21.37 270 top
U3  MAX98357AETE+T  [TQFN-16_L3.0-W3.0-P0.50-BL-EP1.5]  6.33 41.94 180 top
U4  AMS1117-3.3  [SOT-223-4_L6.5-W3.5-P2.30-LS7.0-BR]  18.67 25.17 270 top
U6  XC6206-2.8V  [SOT-23-3_L2.9-W1.6-P1.90-LS2.8-BR]  49.65 39.39 0 bottom
U8  EV_INMP441-FX  [MID-SMD_L4.7-W3.8_INMP441ACEZ]  6.35 52.98 90 top
U9  ZX-MX1.25-2PWZ  [CONN-TH_2P-P1.25_ZX-MX1.25-2PWZ]  4.82 32.54 270 top
U10  ZX-MX1.25-4PWZ  [CONN-TH_4P-P1.25_ZX-MX1.25-4PWZ]  4.83 20.72 270 top
WS  XL-2020RGBC-WS2812B  [LED-SMD_4P-L2.0-W2.0-BR-1]  54.99 62.89 0 top

## Footprints (pads in the part's own frame, mm; a bottom-side part is the same pattern mirrored in y, then rotated)
C0402
  rect 0.79x0.54 smd: 1(-0.545,0) 2(0.545,0)
C0603
  rect 0.8x0.9 smd: 1(-0.7,0) 2(0.7,0)
CASE-B_3528
  rect 1.506x2.376 smd: 1(-1.861,0) 2(1.861,0)
CONN-TH_2P-P1.25_ZX-MX1.25-2PWZ
  oval 0.9x1.5 hole 0.7: 1(0.625,0) 2(-0.625,0)
CONN-TH_4P-P1.25_ZX-MX1.25-4PWZ
  oval 0.9x1.5 hole 0.7: 1(-1.875,0) 2(-0.625,0) 3(0.625,0) 4(1.875,0)
FPC-SMD_6P-P0.50_DEALON_0.5K-DX-6PWB
  rect 0.3x1.25 smd: 1(-1.25,1.262) 2(-0.75,1.262) 3(-0.25,1.262) 4(0.25,1.262) 5(0.75,1.262) 6(1.25,1.262)
  rect 1.8x2.2 smd: 7(3.15,-1.262) 8(-3.15,-1.262)
FPC-SMD_18P-P0.50_FPC-05F-18PH20
  rect 0.3x1.25 smd: 1(4.25,1.288) 2(3.75,1.288) 3(3.25,1.288) 4(2.75,1.288) 5(2.25,1.288) 6(1.75,1.288) 7(1.25,1.288) 8(0.75,1.288) 9(0.25,1.288) 10(-0.25,1.288) 11(-0.75,1.288) 12(-1.25,1.288) 13(-1.75,1.288) 14(-2.25,1.288) 15(-2.75,1.288) 16(-3.25,1.288) 17(-3.75,1.288) 18(-4.25,1.288)
  rect 2x2.5 smd: 19(5.94,-1.288) 20(-5.94,-1.252)
FPC-SMD_P0.50-10P_LCS-SJ-H2.0
  rect 0.3x1.2 smd: 1(2.25,-1.085) 2(1.75,-1.085) 3(1.25,-1.085) 4(0.75,-1.085) 5(0.25,-1.085) 6(-0.25,-1.085) 7(-0.75,-1.085) 8(-1.25,-1.085) 9(-1.75,-1.085) 10(-2.25,-1.085)
  rect 2.2x3.3 smd: 11(-3.85,1.085) 12(3.85,1.085)
LED0603-RD_RED
  rect 0.8x0.8 smd: 1(-0.799,-0.004) 2(0.799,0.004)
LED-SMD_4P-L2.0-W2.0-BR-1
  rect 0.85x0.65 smd: 1(0.675,-0.65) 2(0.675,0.65) 3(-0.675,0.65) 4(-0.675,-0.65)
MID-SMD_L4.7-W3.8_INMP441ACEZ
  rect 0.4x0.6 smd: 1(-1.575,-1.33) 2(-0.525,-1.33) 3(0.525,-1.33) 4(1.575,-1.33) 6(1.575,1.33) 7(0.525,1.33) 8(-0.525,1.33) 9(-1.575,1.33)
  custom 1.626x0.963 smd: 5(1.575,0.664)
  custom 1.626x0.966 smd: 5(1.575,-0.661)
R0402
  rect 0.566x0.54 smd: 1(-0.433,0) 2(0.433,0)
Screw-Hole-M2
  round 2 hole 2: 1(0,0)
SOP-16_L10.0-W3.9-P1.27-LS6.0-BL
  oval 0.56x1.745 smd: 1(-4.445,-2.873) 2(-3.175,-2.873) 3(-1.905,-2.873) 4(-0.635,-2.873) 5(0.635,-2.873) 6(1.905,-2.873) 7(3.175,-2.873) 8(4.445,-2.873) 9(4.445,2.873) 10(3.175,2.873) 11(1.905,2.873) 12(0.635,2.873) 13(-0.635,2.873) 14(-1.905,2.873) 15(-3.175,2.873) 16(-4.445,2.873)
SOT-23-3_L2.9-W1.3-P1.90-LS2.3-BR
  rect 1.07x0.532 smd: 1(0.99,-0.95) 2(0.99,0.95) 3(-0.99,0)
SOT-23-3_L2.9-W1.6-P1.90-LS2.8-BR
  rect 1.07x0.6 smd: 1(1.235,-0.95) 2(1.235,0.95) 3(-1.235,0)
SOT-23_L2.9-W1.3-P1.90-LS2.4-BR
  rect 1x0.8 smd: 1(1.15,-0.95) 2(1.15,0.95) 3(-1.15,0)
SOT-223-4_L6.5-W3.5-P2.30-LS7.0-BR
  rect 2.47x0.98 smd: 1(2.835,-2.3) 2(2.835,0) 3(2.835,2.3)
  rect 2.47x3.6 smd: 4(-2.835,0)
SW-SMD_L3.9-W3.0-P4.45
  rect 1.23x1.36 smd: 1(-2.185,0) 2(2.185,0)
TF-SMD_TF-01A
  rect 0.6x1.3 smd: 1(2.24,5.276) 2(1.14,5.276) 3(0.04,5.276) 4(-1.06,5.276) 5(-2.16,5.276) 6(-3.26,5.276) 7(-4.36,5.276) 8(-5.46,5.276) 9(-6.56,5.276)
  rect 1.2x1.4 smd: 10(-7.76,4.426) 13(6.92,4.426)
  rect 1.2x2 smd: 11(-7.76,-5.276) 12(7.76,-5.276)
TQFN-16_L3.0-W3.0-P0.50-BL-EP1.5
  rect 0.25x0.6 smd: 1(-0.749,-1.5) 2(-0.248,-1.5) 3(0.252,-1.5) 4(0.751,-1.5) 9(0.75,1.5) 10(0.25,1.5) 11(-0.25,1.5) 12(-0.749,1.5)
  rect 0.6x0.25 smd: 5(1.5,-0.748) 6(1.5,-0.248) 7(1.5,0.252) 8(1.5,0.752) 13(-1.5,0.752) 14(-1.5,0.252) 15(-1.5,-0.248) 16(-1.5,-0.748)
  rect 1.5x1.5 smd: 17(0,0)
USB-C-SMD_KH-TYPE-C-16P
  oval 1x2 hole 0.6x1.7: 1(-4.32,1.765) 2(4.32,1.765)
  oval 1x1.8 hole 0.6x1.4: 3(-4.32,-2.415) 4(4.32,-2.415)
  rect 0.3x1.3 smd: A1(-3.35,2.415) A4(-2.55,2.415) A5(-1.25,2.415) A6(-0.25,2.415) A7(0.25,2.415) A8(1.25,2.415) A9(2.55,2.415) A12(3.35,2.415) B1(3.05,2.415) B4(2.25,2.415) B5(1.75,2.415) B6(0.75,2.415) B7(-0.75,2.415) B8(-1.75,2.415) B9(-2.25,2.415) B12(-3.05,2.415)
WIRELM-SMD_ESP32-S3-WROOM-1
  rect 1.5x0.9 smd: 1(-8.75,8.895) 2(-8.75,7.625) 3(-8.75,6.355) 4(-8.75,5.085) 5(-8.75,3.815) 6(-8.75,2.545) 7(-8.75,1.275) 8(-8.75,0.005) 9(-8.75,-1.265) 10(-8.75,-2.535) 11(-8.75,-3.805) 12(-8.75,-5.075) 13(-8.75,-6.345) 14(-8.75,-7.615) 27(8.75,-7.615) 28(8.75,-6.345) 29(8.75,-5.075) 30(8.75,-3.805) 31(8.75,-2.535) 32(8.75,-1.265) 33(8.75,0.005) 34(8.75,1.275) 35(8.75,2.545) 36(8.75,3.815) 37(8.75,5.085) 38(8.75,6.355) 39(8.75,7.625) 40(8.75,8.895)
  rect 0.9x1.5 smd: 15(-6.985,-8.895) 16(-5.715,-8.895) 17(-4.445,-8.895) 18(-3.175,-8.895) 19(-1.905,-8.895) 20(-0.635,-8.895) 21(0.635,-8.895) 22(1.905,-8.895) 23(3.175,-8.895) 24(4.445,-8.895) 25(5.715,-8.895) 26(6.985,-8.865)
  rect 0.9x0.9 smd: 41(-2.9,2.575) 41(-2.9,1.175) 41(-2.9,-0.225) 41(-1.5,2.575) 41(-1.5,1.175) 41(-1.5,-0.225) 41(-0.1,2.575) 41(-0.1,1.175) 41(-0.1,-0.225)

## Nets
2.8V: C13.2 C14.1 FPC3.2 U6.2
+5V: C10.2 C11.1 C19.1 C20.2 OTG.A4 OTG.A9 OTG.B4 OTG.B9 TTL.A4 TTL.A9 TTL.B4 TTL.B9 U2.16 U4.3 U10.4 WS.4
GND: BOOT.2 C2.2 C3.1 C4.1 C5.1 C6.2 C7.1 C8.1 C9.1 C10.1 C11.2 C12.2 C13.1 C14.2 C16.1 C18.1 C19.2 C20.1 C21.1 C22.1 C23.1 CARD1.6 CARD1.10 CARD1.11 CARD1.12 CARD1.13 FPC1.1 FPC1.7 FPC1.8 FPC2.1 FPC2.5 FPC2.6 FPC2.12 FPC2.18 FPC2.19 FPC2.20 FPC3.1 FPC3.11 FPC3.12 IO41.2 IO42.2 LED.1 OTG.1 OTG.2 OTG.3 OTG.4 OTG.A1 OTG.A12 OTG.B1 OTG.B12 PWR.1 Q4.2 Q7.2 R7.2 R9.1 R15.2 R16.1 R20.1 R25.1 R28.1 R29.1 RST.2 TTL.1 TTL.2 TTL.3 TTL.4 TTL.A1 TTL.A12 TTL.B1 TTL.B12 U1.1 U1.40 U1.41 U2.1 U3.3 U3.11 U3.15 U3.17 U4.1 U6.1 U8.4 U8.5 U8.6 U8.9 U10.1 WS.2
VCC: C6.1 C7.2 C8.2 C9.2 C12.1 C16.2 C18.2 C22.2 C23.2 CARD1.4 FPC1.6 FPC2.3 FPC2.4 FPC2.17 FPC3.7 R2.2 R3.2 R4.2 R5.2 R6.2 R8.2 R12.2 R14.2 R21.1 R22.1 R30.2 R31.2 R32.2 R34.2 U1.2 U3.7 U3.8 U4.2 U4.4 U6.3 U8.7 U8.8
DTR: Q6.2 R10.2 U2.13
EN: C2.1 Q1.3 R30.1 RST.1 U1.3
IO0: BOOT.1 C4.2 Q6.3 R12.1 R31.1 U1.27
IO1_WS: U1.39 WS.3
IO2_LED: R1.2 U1.38
IO4_I2S_MIC_WS: U1.4 U8.3
IO5_I2S_MIC_SCK: U1.5 U8.1
IO6_I2S_MIC_DIN: R9.2 U1.6 U8.2
IO7_I2S_SPK_DOUT: U1.7 U3.1
IO9_TP_INT: FPC1.3 FPC2.16 U1.17
IO10_TP_RST: FPC1.2 FPC2.15 U1.18
IO11_I2C_SDA: FPC1.4 FPC2.14 R21.2 U1.19
IO12_I2C_SCL: FPC1.5 FPC2.13 R22.2 U1.20
IO13_LCD_RST: FPC2.11 FPC3.6 U1.21
IO14_LCD_MOSI: FPC2.10 FPC3.3 U1.22
IO15_I2S_SPK_BCLK: U1.8 U3.16
IO16_I2S_SPK_LRCK: U1.9 U3.14
IO19: OTG.A7 OTG.B7 U1.13
IO20: OTG.A6 OTG.B6 U1.14
IO21_LCD_CLK: FPC2.9 FPC3.4 U1.23
IO38_SD_CMD: CARD1.3 R5.1 U1.31
IO39_SD_CLK: CARD1.5 R6.1 U1.32
IO40_SD_DATA: CARD1.7 R4.1 U1.33
IO41_BTN2: C5.2 IO41.1 R34.1 U1.34
IO42_BTN1: C3.2 IO42.1 R32.1 U1.35
IO45_LCD_BLK: Q7.1 R20.2 R24.1 U1.26
IO47_LCD_CS: FPC2.8 FPC3.5 U1.24
IO48_LCD_DC: FPC2.7 FPC3.10 U1.25
LCD_BLK: FPC2.2 R19.2
LEDK: FPC3.8 R23.2
RTS: Q1.2 R11.2 U2.14
RXD0: R26.2 U1.36
TXD0: R27.2 TX.1 U1.37
USB1_CC1: R16.2 TTL.B5
USB1_CC2: R15.1 TTL.A5
USB2_CC1: OTG.B5 R29.2
USB2_CC2: OTG.A5 R28.2
USB_DN: TTL.A7 TTL.B7 U2.6
USB_DP: TTL.A6 TTL.B6 U2.5
$1N5016: R7.1 U3.2
$1N5089: R8.1 U3.4
$1N5351: U3.10 U9.1
$1N5372: U3.9 U9.2
$1N6944: Q1.1 R10.1
$1N6949: Q6.1 R11.1
$1N7412: PWR.2 R3.1
$1N7416: R2.1 TX.2
$1N7421: LED.2 R1.1
$1N7694: R13.1 U1.15
$1N7805: R13.2 R14.1
$1N9339: Q4.1 R24.2 R25.2
$1N9344: Q4.3 R23.1
$1N9896: R26.1 U2.2
$1N9901: R27.1 U2.3
$1N9958: C21.2 U2.4
$1N14603: U1.10 U10.2
$1N14611: U1.11 U10.3
$1N17288: Q7.3 R19.1

Pads without a net: CARD1 1 2 8 9; FPC3 9; OTG A8 B8; SCREW1 1; SCREW2 1; SCREW3 1; SCREW4 1; TTL A8 B8; U1 12 16 28 29 30; U2 7 8 9 10 11 12 15; U3 5 6 12 13; WS 1

## Via types
v1: diameter 0.61, hole 0.305, Top Layer to Bottom Layer, 148 vias

## Routing (per net, layer and track width the routed paths; a pad name or vN(x,y) marks a point on that pad's centre or on a via; arc(x,y) is an arc through that point)
2.8V: length 6.7
  Bottom Layer w0.254: C14.1 54.74,38.72 54.74,35.46 55.02,35.17 FPC3.2
+5V: length 199.2
  Top Layer w0.254: TTL.B4 33.02,7.32 33.02,6.75 32.64,6.37 32.64,5.74 32.26,5.36 28.96,5.36 28.36,5.96 TTL.B9 ; 28.06,7.48 28.07,7.49 ; OTG.A9 15.48,7.52 ; 15.2,7.48 15.36,7.32 15.14,7.09 15.14,5.9 14.6,5.36 11.3,5.36 10.67,5.99 10.67,7.45
  Top Layer w0.5: U10.4 9.11,18.85 10.54,17.42 10.54,7.53 10.59,7.48 ; 15.19,7.48 15.19,8.1 15.44,8.35 15.44,8.99 16.13,9.68 21.34,9.68 ; 21.34,9.68 27.18,9.68 28.11,8.74 28.11,7.48 ; 21.34,9.68 20.98,10.03 20.98,17.2 C10.2 ; WS.4 54.3,62.25 v1(52.45,62.25)
  PWR w0.5: v1(40.01,25.68) 40.01,17.04 39.5,16.53 v1(22.61,16.53) ; v1(41.15,25.68) 41.15,16.15 41.66,15.64 75.69,15.64 76.83,16.79 76.83,59.08 75.06,60.86 52.96,60.86 52.45,61.36 v1(52.45,62.25)
  vias: v1(22.61,23.23) v1(22.61,21.87) v1(22.61,20.47) v1(22.61,19.06) v1(22.61,17.68) v1(34.04,26.95)
GND:
  vias: v1(4.32,44.09) v1(6.33,41.94) v1(12.51,18.66) v1(12.51,16.66) v1(12.51,14.66) v1(14.51,14.66) v1(16.51,14.66) v1(16.51,12.66) v1(18.51,14.66) v1(18.51,12.66) v1(24.41,56.19) v1(24.41,54.79) v1(24.41,53.39) v1(24.51,14.66) v1(24.51,12.66) v1(25.8,56.19) v1(25.8,54.79) v1(25.8,53.39) v1(26.51,14.66) v1(26.51,12.66) v1(27.2,56.19) v1(27.2,54.79) v1(27.2,53.39) v1(28.51,14.66) v1(34.51,12.66) v1(36.51,12.66) v1(38.51,12.66) v1(38.51,6.66) v1(40.51,12.66) v1(40.51,6.66) v1(42.51,12.66) v1(42.51,6.66) v1(44.51,12.66) v1(44.51,6.66) v1(46.51,6.66) v1(48.51,6.66) v1(50.51,6.66) v1(52.45,24.53) v1(52.51,6.66) v1(52.51,2.66) v1(54.51,2.66) v1(56.51,2.66) v1(56.77,24.03) v1(58.51,8.66) v1(58.51,2.66) v1(60.51,66.66) v1(60.51,64.66) v1(60.51,62.66) v1(60.51,8.66) v1(60.51,2.66) v1(62.51,66.66) v1(62.51,64.66) v1(62.51,62.66) v1(62.51,8.66) v1(62.51,2.66) v1(64.51,54.66) v1(64.51,50.66) v1(64.51,8.66) v1(66.51,54.66) v1(66.51,50.66) v1(66.51,8.66) v1(68.51,50.66) v1(68.51,8.66) v1(70.51,8.66) v1(72.51,46.66) v1(72.51,44.66) v1(72.51,42.66) v1(72.51,24.66) v1(72.51,22.66) v1(72.51,20.66) v1(74.51,46.66) v1(74.51,44.66) v1(74.51,42.9) v1(74.51,40.66) v1(74.51,24.66) v1(74.51,22.66) v1(74.51,20.66) v1(75.95,56.41) v1(80.51,54.66) v1(80.51,52.66) v1(80.51,40.17) v1(80.51,28.66) v1(80.51,16.66) v1(80.51,8.66) v1(80.51,6.66) v1(82.51,54.66) v1(82.51,52.66) v1(86.51,54.66) v1(86.51,52.66) v1(86.51,50.66)
VCC: length 346.5
  Top Layer w0.254: v1(53.34,26.57) 53.34,27.07 53.59,27.33 55.12,27.33 55.3,27.14 FPC2.17 ; R21.1 25.4,40.79 26.16,40.03 v1(26.16,39.39) 26.42,39.39 26.67,39.65 26.67,41.58 R22.1
  Top Layer w0.3: v1(78.99,23.09) 79.06,23.15 R31.2 ; R34.2 80.23,33.89 v1(78.99,33.89) ; v1(63.88,30) 63.88,28.85 63.63,28.6 62.83,28.6 C23.2 ; v1(78.99,44.58) 79.06,44.51 R32.2 ; v1(15.49,61.24) 18.55,61.24 U1.2 ; FPC2.4 61.8,27.63 61.34,28.09 C16.2 61.4,28.63 62.68,28.63 C23.2 ; C7.2 73.83,52.68 CARD1.4 ; C23.2 62.74,28.09 62.3,27.66 FPC2.3 ; v1(3.05,45.87) 2.03,45.87 1.65,45.49 1.65,42.19 2.2,41.64 C8.2 4.78,41.64 U3.7 U3.8 ; v1(3.05,45.87) 5.13,45.87 5.21,45.8 ; v1(3.05,45.87) 3.05,48.28 2.03,49.3 2.03,52.09 2.41,52.47 C9.2 5,52.47 5.02,52.46 U8.7 ; 80.26,12.52 80.21,12.47 v1(78.99,12.47) ; R2.2 46.08,63.52 v1(44.32,63.52) 42.61,63.52 R3.2 ; R14.2 16.56,43.51 16.13,43.08 16.13,38.25 16.64,37.74 v1(18.63,37.74) C12.1 ; v1(37.97,43.46) R12.2
  PWR w0.3: 37.93,39.39 v1(26.16,39.39) ; 37.93,39.39 37.97,39.43 v1(37.97,43.46) ; 37.93,39.39 44.27,39.39 ; v1(26.16,39.39) 18.92,39.39 18.63,39.1 v1(18.63,37.74) ; v1(26.16,39.39) 26.16,30.76 26.92,30 45.35,30 ; v1(44.32,63.52) 44.32,39.45 44.27,39.39 ; v1(3.05,45.87) 3.05,37.49 4.83,35.71 18.03,35.71 18.63,36.31 v1(18.63,37.74) ; 45.35,30 45.35,27.32 46.1,26.57 ; 45.35,30 v1(63.88,30) ; 46.1,26.57 46.23,26.44 v1(46.23,21.61) ; 46.1,26.57 v1(53.34,26.57) ; v1(15.49,61.24) 14.86,61.24 14.35,60.73 14.35,38.25 14.86,37.74 v1(18.63,37.74) ; 44.27,39.39 69.21,39.39 70.61,40.79 v1(70.61,51.71) ; v1(78.99,51.84) v1(78.99,44.58) v1(78.99,33.89) v1(78.99,23.09) v1(78.99,12.47)
  Bottom Layer w0.254: v1(46.23,21.61) 46.27,21.65 C18.2
  Bottom Layer w0.3: v1(63.88,30) 63.88,32.15 63.37,32.66 58.11,32.66 FPC3.7 ; U6.3 48.42,39.39 38.73,39.39 37.97,40.16 v1(37.97,43.46) ; FPC1.6 53.58,21.65 C18.2
  vias: v1(17.4,36.47) v1(17.4,34.31) v1(17.91,25.55) v1(18.03,30) v1(18.67,24.61) v1(19.12,30) v1(19.31,25.55) v1(20.32,30)
DTR: length 26.7
  Top Layer w0.254: 31.11,30.66 31.11,22.5 31.62,22 U2.13 ; 31.11,30.66 31.08,30.63 27.94,30.63 27.56,31.01 27.56,34.06 28.07,34.57 33.78,34.57 34.1,34.25 Q6.2 ; 31.11,30.66 31.11,31.72 R10.2
EN: length 123.8
  Top Layer w0.254: v1(20.95,59.97) 18.56,59.97 U1.3 ; v1(78.49,11.58) 78.56,11.66 R30.1 82.7,11.66 RST.1 82.7,14.02 83.14,14.45 C2.1 ; Q1.3 v1(21.34,35.68)
  Bottom Layer w0.254: v1(78.49,11.58) 22.73,11.58 21.34,12.98 v1(21.34,35.68) 21.34,59.59 v1(20.95,59.97)
IO0: length 86.4
  Top Layer w0.254: 36.14,45.92 36.2,45.86 v1(36.2,42.19) ; 36.14,45.92 U1.27 ; 36.14,45.92 R12.1 ; Q6.3 v1(36.2,35.56) 48.41,35.56 49.02,34.95 49.02,18.69 49.66,18.06 79.5,18.06 80.26,18.82 R31.1 82.66,22.29 BOOT.1 82.7,24.3 83.33,24.94 84.14,24.94 C4.2
  Bottom Layer w0.254: v1(36.2,35.56) v1(36.2,42.19)
IO1_WS: length 24.7
  Top Layer w0.254: WS.3 54.36,63.58 54.36,65.68 53.85,66.19 42.42,66.19 42.39,66.17 39.1,66.17 38.12,65.19 38.12,61.9 37.47,61.24 U1.39
IO2_LED: length 20.8
  Top Layer w0.254: U1.38 37.85,59.97 38.48,60.6 38.48,65.05 39.24,65.81 49.28,65.81 49.78,65.31 R1.2
IO4_I2S_MIC_WS: length 15.2
  Top Layer w0.254: U8.3 7.7,53.49 9.27,53.49 9.78,54 9.78,57.68 10.8,58.7 U1.4
IO5_I2S_MIC_SCK: length 16.3
  Top Layer w0.254: U8.1 7.73,51.46 9.91,51.46 10.29,51.84 10.29,56.79 10.93,57.43 U1.5
IO6_I2S_MIC_DIN: length 20.8
  Top Layer w0.254: 7.68,52.46 7.66,52.47 7.11,52.47 6.78,52.15 R9.2 10.16,49.81 10.8,50.44 10.8,55.65 11.31,56.16 U1.6
IO7_I2S_SPK_DOUT: length 22.3
  Top Layer w0.254: U1.7 11.82,54.89 11.3,54.38 11.3,43.97 10.8,43.46 7.09,43.46 7.08,43.44
IO9_TP_INT: length 62.9
  Top Layer w0.254: FPC2.16 55.8,22.05 54.99,21.23 51.05,21.23 50.29,21.99 v1(50.29,23.12) 50.29,35.84 49.15,36.98 23.49,36.98 22.86,37.62 U1.17
  Bottom Layer w0.254: FPC1.3 53.59,23.12 v1(50.29,23.12)
IO10_TP_RST: length 54.8
  Top Layer w0.254: FPC2.15 56.3,27.16 55.73,27.73 51.92,27.73 v1(51.66,27.99) 51.18,28.47 51.18,36.47 50.32,37.34 25.18,37.34 24.13,38.38 U1.18
  Bottom Layer w0.254: v1(51.66,27.99) 51.66,23.92 51.94,23.65 53.59,23.65 FPC1.2
IO11_I2C_SDA: length 58.6
  Top Layer w0.254: FPC2.14 56.77,26.37 56.77,27.58 56.26,28.09 53.09,28.09 v1(52.71,28.47) 52.2,28.98 52.2,36.47 50.98,37.69 25.32,37.69 24.51,38.5 24.51,42.19 24.82,42.49 R21.2 U1.19
  Bottom Layer w0.254: FPC1.4 53.61,22.63 54.86,22.63 55.24,23.01 55.24,24.41 54.74,24.92 53.09,24.92 52.71,25.29 v1(52.71,28.47)
IO12_I2C_SCL: length 60.2
  Top Layer w0.254: FPC2.13 57.3,27.81 56.67,28.44 54.13,28.44 v1(53.61,28.96) 53.09,29.49 53.09,36.47 51.51,38.05 28.4,38.05 27.61,38.83 27.61,42.26 27.43,42.44 26.77,42.44 R22.2 26.67,42.54 U1.20
  Bottom Layer w0.254: 53.72,22.12 56.77,22.12 57.53,22.88 57.53,28.22 56.79,28.96 v1(53.61,28.96)
IO13_LCD_RST: length 50.7
  Top Layer w0.254: FPC2.11 58.29,26.34 58.29,27.96 57.46,28.8 54.92,28.8 53.72,30 v1(53.72,32.71) 53.72,36.85 52.17,38.4 28.8,38.4 28.19,39.01 28.19,44.47 U1.21
  Bottom Layer w0.254: v1(53.72,32.71) 56.98,32.71 57.38,33.1 58.03,33.1 FPC3.6
IO14_LCD_MOSI: length 48.9
  Top Layer w0.254: FPC2.10 58.8,28.34 57.99,29.16 56.34,29.16 54.36,31.14 v1(54.36,34.65) 54.36,37.36 52.96,38.76 29.84,38.76 29.21,39.39 U1.22
  Bottom Layer w0.254: FPC3.3 58.07,34.65 v1(54.36,34.65)
IO15_I2S_SPK_BCLK: length 21
  Top Layer w0.254: U3.16 7.84,42.7 11.18,42.7 11.81,43.33 11.81,53.11 12.32,53.62 U1.8
IO16_I2S_SPK_LRCK: length 20.4
  Top Layer w0.254: U3.14 7.84,41.68 11.18,41.68 12.32,42.82 12.32,51.84 12.83,52.35 U1.9
IO19: length 47.2
  Top Layer w0.124: OTG.A7 13.14,8.34 ; 13.14,8.34 12.95,8.53 12.32,8.53 12.14,8.36 OTG.B7 ; 13.14,8.34 13.14,9.42 13.23,9.51 13.23,10.26 arc(13.19,10.36) 13.09,10.4 arc(12.99,10.44) 12.95,10.54 12.95,10.76 arc(12.99,10.86) 13.09,10.9 arc(13.19,10.94) 13.23,11.04 13.23,11.26 arc(13.19,11.36) 13.09,11.4 arc(12.99,11.44) 12.95,11.54 12.95,11.76 arc(12.99,11.86) 13.09,11.9 arc(13.19,11.94) 13.23,12.04 13.23,12.26 arc(13.19,12.36) 13.09,12.4 arc(12.99,12.44) 12.95,12.54 12.95,12.76 arc(12.99,12.86) 13.09,12.9 arc(13.19,12.94) 13.23,13.04 13.23,45.64 14.32,46.73 16.88,46.73 16.95,46.8 17.21,46.8 17.68,47.27 U1.13
IO20: length 47
  Top Layer w0.124: U1.14 17.68,46 17.21,46.47 17.09,46.47 17.01,46.4 14.46,46.4 13.56,45.5 13.56,9.51 13.64,9.42 OTG.B6 13.64,6.43 13.46,6.25 12.7,6.25 12.57,6.37 12.57,7.41 OTG.A6
IO21_LCD_CLK: length 47.9
  Top Layer w0.254: FPC2.9 59.3,28.86 58.65,29.51 57,29.51 54.99,31.52 v1(54.99,34.04) 54.99,38.25 54.12,39.12 31.14,39.12 30.48,39.77 U1.23
  Bottom Layer w0.254: v1(54.99,34.04) 55.61,34.04 55.75,34.19 58.08,34.19 FPC3.4
IO38_SD_CMD: length 39.5
  Top Layer w0.254: U1.31 37.6,51.08 38.48,51.97 68.07,51.97 69.01,52.91 R5.1 72.26,53.49 72.77,54 72.77,55.16 CARD1.3
IO39_SD_CLK: length 47.1
  Top Layer w0.254: U1.32 67.95,52.35 68.81,53.22 68.81,56.51 69.47,57.17 74.55,57.17 74.93,56.79 CARD1.5 74.93,54 75.44,53.49 R6.1
IO40_SD_DATA: length 49.6
  Top Layer w0.254: U1.33 37.59,53.62 38.48,52.73 67.82,52.73 68.45,53.36 68.45,56.67 69.34,57.55 76.45,57.55 77.13,56.88 77.13,52.95 R4.1
IO41_BTN2: length 86.6
  Top Layer w0.254: 84.34,35.78 84.16,35.96 83.18,35.96 82.7,35.48 IO41.1 82.7,32.99 R34.1 78.92,32.99 78.23,33.68 78.23,45.62 83.97,51.36 83.97,57.12 82.03,59.06 64.91,59.06 64.19,58.34 64.19,56.31 63.28,55.4 38.86,55.4 38.36,54.89 U1.34
IO42_BTN1: length 69.5
  Top Layer w0.254: R32.1 82.68,43.65 IO42.1 82.68,43.69 82.68,46 83.14,46.46 C3.2 84.33,46.48 84.33,57.3 82.18,59.44 64.75,59.44 63.81,58.5 63.81,56.46 63.12,55.78 38.86,55.78 38.48,56.16 U1.35
IO45_LCD_BLK: length 86.3
  Top Layer w0.254: v1(72.14,28.85) 70.66,28.85 R20.2 68.72,28.8 68.71,28.79 ; v1(72.11,40.18) 35.02,40.18 34.29,40.92 v1(34.29,41.65) U1.26
  Bottom Layer w0.254: v1(72.14,28.85) 72.14,40.16 v1(72.11,40.18) ; v1(34.29,41.65) 34.29,28.09 35.18,27.2 49.86,27.2 R24.1
IO47_LCD_CS: length 47.1
  Top Layer w0.254: U1.24 31.75,40.16 32.43,39.47 55.04,39.47 55.63,38.89 v1(55.63,33.38) 55.63,31.39 57.15,29.87 59.18,29.87 59.82,29.23 59.82,26.34 FPC2.8
  Bottom Layer w0.254: FPC3.5 58.09,33.68 56.26,33.68 55.96,33.38 v1(55.63,33.38)
IO48_LCD_DC: length 45.7
  Top Layer w0.254: FPC2.7 60.33,26.35 60.33,29.36 59.44,30.25 57.28,30.25 56.39,31.14 v1(56.39,31.57) 56.39,38.89 55.45,39.83 33.6,39.83 33.02,40.41 U1.25
  Bottom Layer w0.254: FPC3.10 58.06,31.14 57.15,31.14 56.72,31.57 v1(56.39,31.57)
LCD_BLK: length 4.5
  Top Layer w0.254: FPC2.2 62.8,27.01 63.12,27.33 64.77,27.33 65.02,27.58 R19.2
LEDK: length 4.8
  Bottom Layer w0.254: R23.2 53.85,32.03 53.99,32.17 FPC3.8
RTS: length 13.2
  Top Layer w0.254: U2.14 33.14,23.27 32.77,23.65 32.77,31.59 R11.2 32.59,32.33 32.26,32.66 30.73,32.66 30.55,32.84 30.55,33.69 Q1.2
RXD0: length 43
  Top Layer w0.254: v1(33.02,57.3) 35.92,57.3 U1.36 ; v1(24.89,34.95) 24.64,34.69 24.64,25.04 24.88,24.8 R26.2
  Bottom Layer w0.254: v1(33.02,57.3) 32,56.28 32,51.08 31.36,50.44 25.65,50.44 24.89,49.68 v1(24.89,34.95)
TXD0: length 60.6
  Top Layer w0.254: v1(32.89,58.57) 35.92,58.57 U1.37 38.48,58.7 38.99,58.19 38.99,56.79 39.55,56.23 45.47,56.23 46.17,56.93 TX.1 ; v1(23.97,34.85) 24.26,34.57 24.26,23.65 24.63,23.27 R27.2
  Bottom Layer w0.254: v1(32.89,58.57) 31.65,57.33 31.65,51.23 31.24,50.82 25.53,50.82 24.54,49.83 24.54,35.42 v1(23.97,34.85)
USB1_CC1: length 3
  Top Layer w0.254: TTL.B5 32.39,7.51 R16.2
USB1_CC2: length 3
  Top Layer w0.254: R15.1 29.36,10.49 TTL.A5
USB2_CC1: length 3
  Top Layer w0.254: OTG.B5 14.64,10.47 R29.2
USB2_CC2: length 3.1
  Top Layer w0.254: OTG.A5 11.64,10.47 R28.2
USB_DN: length 19
  Top Layer w0.124: 30.86,8.41 TTL.A7 ; 30.86,8.41 30.61,8.66 30.1,8.66 29.86,8.42 TTL.B7 ; 30.86,8.41 30.86,8.91 30.94,9 30.94,9.98 arc(30.88,10.14) 30.71,10.21 arc(30.55,10.28) 30.48,10.44 30.48,10.48 arc(30.55,10.64) 30.71,10.71 arc(30.88,10.78) 30.94,10.94 30.94,10.98 arc(30.88,11.14) 30.71,11.21 arc(30.55,11.28) 30.48,11.44 30.48,11.48 arc(30.55,11.64) 30.71,11.71 arc(30.88,11.78) 30.94,11.94 30.94,11.98 arc(30.88,12.14) 30.71,12.21 arc(30.55,12.28) 30.48,12.44 30.48,12.48 arc(30.55,12.64) 30.71,12.71 arc(30.88,12.78) 30.94,12.94 30.94,19.63 30.61,19.96 28.99,19.96 28.96,19.93 28.7,19.93 U2.6
USB_DP: length 19
  Top Layer w0.124: U2.5 28.7,20.26 28.83,20.26 28.86,20.29 30.74,20.29 31.27,19.76 31.27,9 31.36,8.91 TTL.B6 31.36,6.49 31.11,6.25 30.61,6.25 30.36,6.5 TTL.A6
$1N5016: length 1.5
  Top Layer w0.254: 6.58,43.44 6.58,44.9 R7.1
$1N5089: length 1.6
  Top Layer w0.254: 5.58,43.44 5.59,43.45 5.59,44.09 5.21,44.47 R8.1
$1N5351: length 9.1
  Top Layer w0.254: U3.10 6.08,33.09 5.43,32.43 5.34,32.43 U9.1
$1N5372: length 7.6
  Top Layer w0.254: U9.2 5.58,33.92 U3.9
$1N6944: length 3.3
  Top Layer w0.254: R10.1 29.08,31.77 28.7,32.15 28.7,33.64 Q1.1
$1N6949: length 2.9
  Top Layer w0.254: R11.1 33.45,33.25 33.15,33.55 32.22,33.55 Q6.1
$1N7412: length 2.2
  Top Layer w0.254: R3.1 42.54,62.58 PWR.2
$1N7416: length 2.2
  Top Layer w0.254: R2.1 46.16,60.39 TX.2
$1N7421: length 2.2
  Top Layer w0.254: R1.1 49.78,62.58 LED.2
$1N7694: length 2.1
  Top Layer w0.254: R13.1 20.32,42.6 U1.15
$1N7805: length 1.8
  Top Layer w0.254: R14.1 17.71,42.59 R13.2
$1N9339: length 4
  Bottom Layer w0.254: R25.2 47.75,29.89 47.8,29.94 47.94,29.81 Q4.1 49.91,29.67 49.91,28.02
$1N9344: length 1.8
  Bottom Layer w0.254: Q4.3 53.77,30.76 53.85,30.83
$1N9896: length 2.1
  Top Layer w0.254: R26.1 26.79,24.8 27.05,24.53 28.22,24.53 U2.2
$1N9901: length 2
  Top Layer w0.254: R27.1 U2.3
$1N9958: length 2.1
  Top Layer w0.254: U2.4 26.32,22 C21.2
$1N14603: length 42.4
  Top Layer w0.254: v1(15.37,51.2) 18.43,51.2 U1.10 ; U10.2 4.84,21.36 v1(6.6,21.36)
  Bottom Layer w0.254: v1(15.37,51.2) 10.29,51.2 9.27,50.19 9.27,22.5 8.13,21.36 v1(6.6,21.36)
$1N14611: length 42.6
  Top Layer w0.254: U1.11 v1(15.37,49.81) ; U10.3 4.84,20.09 v1(6.6,20.09)
  Bottom Layer w0.254: v1(6.6,20.09) 8.89,20.09 9.91,21.11 9.91,49.3 10.42,49.81 v1(15.37,49.81)
$1N17288: length 1.4
  Top Layer w0.254: 66.41,29.74 65.08,29.74 R19.1

## Copper pours and planes (outline as drawn; the poured copper is in the pictures)
2.8V on Bottom Layer: 50.32,39.12 50.32,39.07 50.32,37.13 56.34,37.13 56.39,37.18 56.39,39.27 50.33,39.27
+5V on Top Layer: 33.19,27.96 42.46,27.96 42.46,25.17 33.19,25.17
+5V on Top Layer: 20.45,24.53 20.45,15.7 20.5,15.64 23.24,15.64 23.24,24.53
+5V on Top Layer: 19.69,9.68 20.98,10.97 22.27,9.68
GND on Top Layer: -4.06,74.7 94.49,74.7 94.49,-5.44 -4.06,-5.44
GND on Bottom Layer: -4.57,74.7 95.63,74.7 95.63,-4.93 -4.57,-4.93
GND on GND: -3.3,74.7 94.49,74.7 94.49,-3.28 -3.3,-3.28
GND on PWR: -3.43,73.43 97.92,73.43 97.92,-4.93 -3.43,-4.93
VCC on Top Layer: 19.18,37.02 19.18,30.63 19.3,30.5 21.08,30.5 21.08,29.62 19.18,20.72 17.98,20.72 16.46,28.93 16.89,30.88 16.89,37.11 19.09,37.11
VCC on Top Layer: 71.76,52.25 72.8,52.25 73.28,52.73 73.28,52.98 74.17,52.98 74.3,53.11 74.3,52.73 74.68,52.35 79.5,52.35 79.5,51.33 74.93,51.33 74.42,51.84 74.42,52.09 73.41,52.09 73.28,52.22 72.9,51.84 72.9,51.59 72.3,50.98 69.85,50.98 69.85,52.35 71.67,52.35
VCC on PWR: 38.87,39.39 37.03,39.39 37.93,40.29 37.97,40.29
VCC on PWR: 44.36,30 45.32,29.03 45.35,29.03 46.23,29.91 46.23,30
VCC on PWR: 45.4,39.39 43.24,39.39 44.32,40.48
VCC on PWR: 45.8,26.87 46.86,26.87 46.86,26.02 45.68,26.02 45.59,26.06 45.59,26.57

Small or netless copper shapes (teardrops, artwork), in the pictures only: 1 on Top Layer

## Text on the board
Bottom Silkscreen Layer: esp32s3-develop-board-v1.0
Top Silkscreen Layer: R/T | GND | 5V | + | - | Author: myry
